# EAGLE design ascender_board (EAGLE 6.6.0)
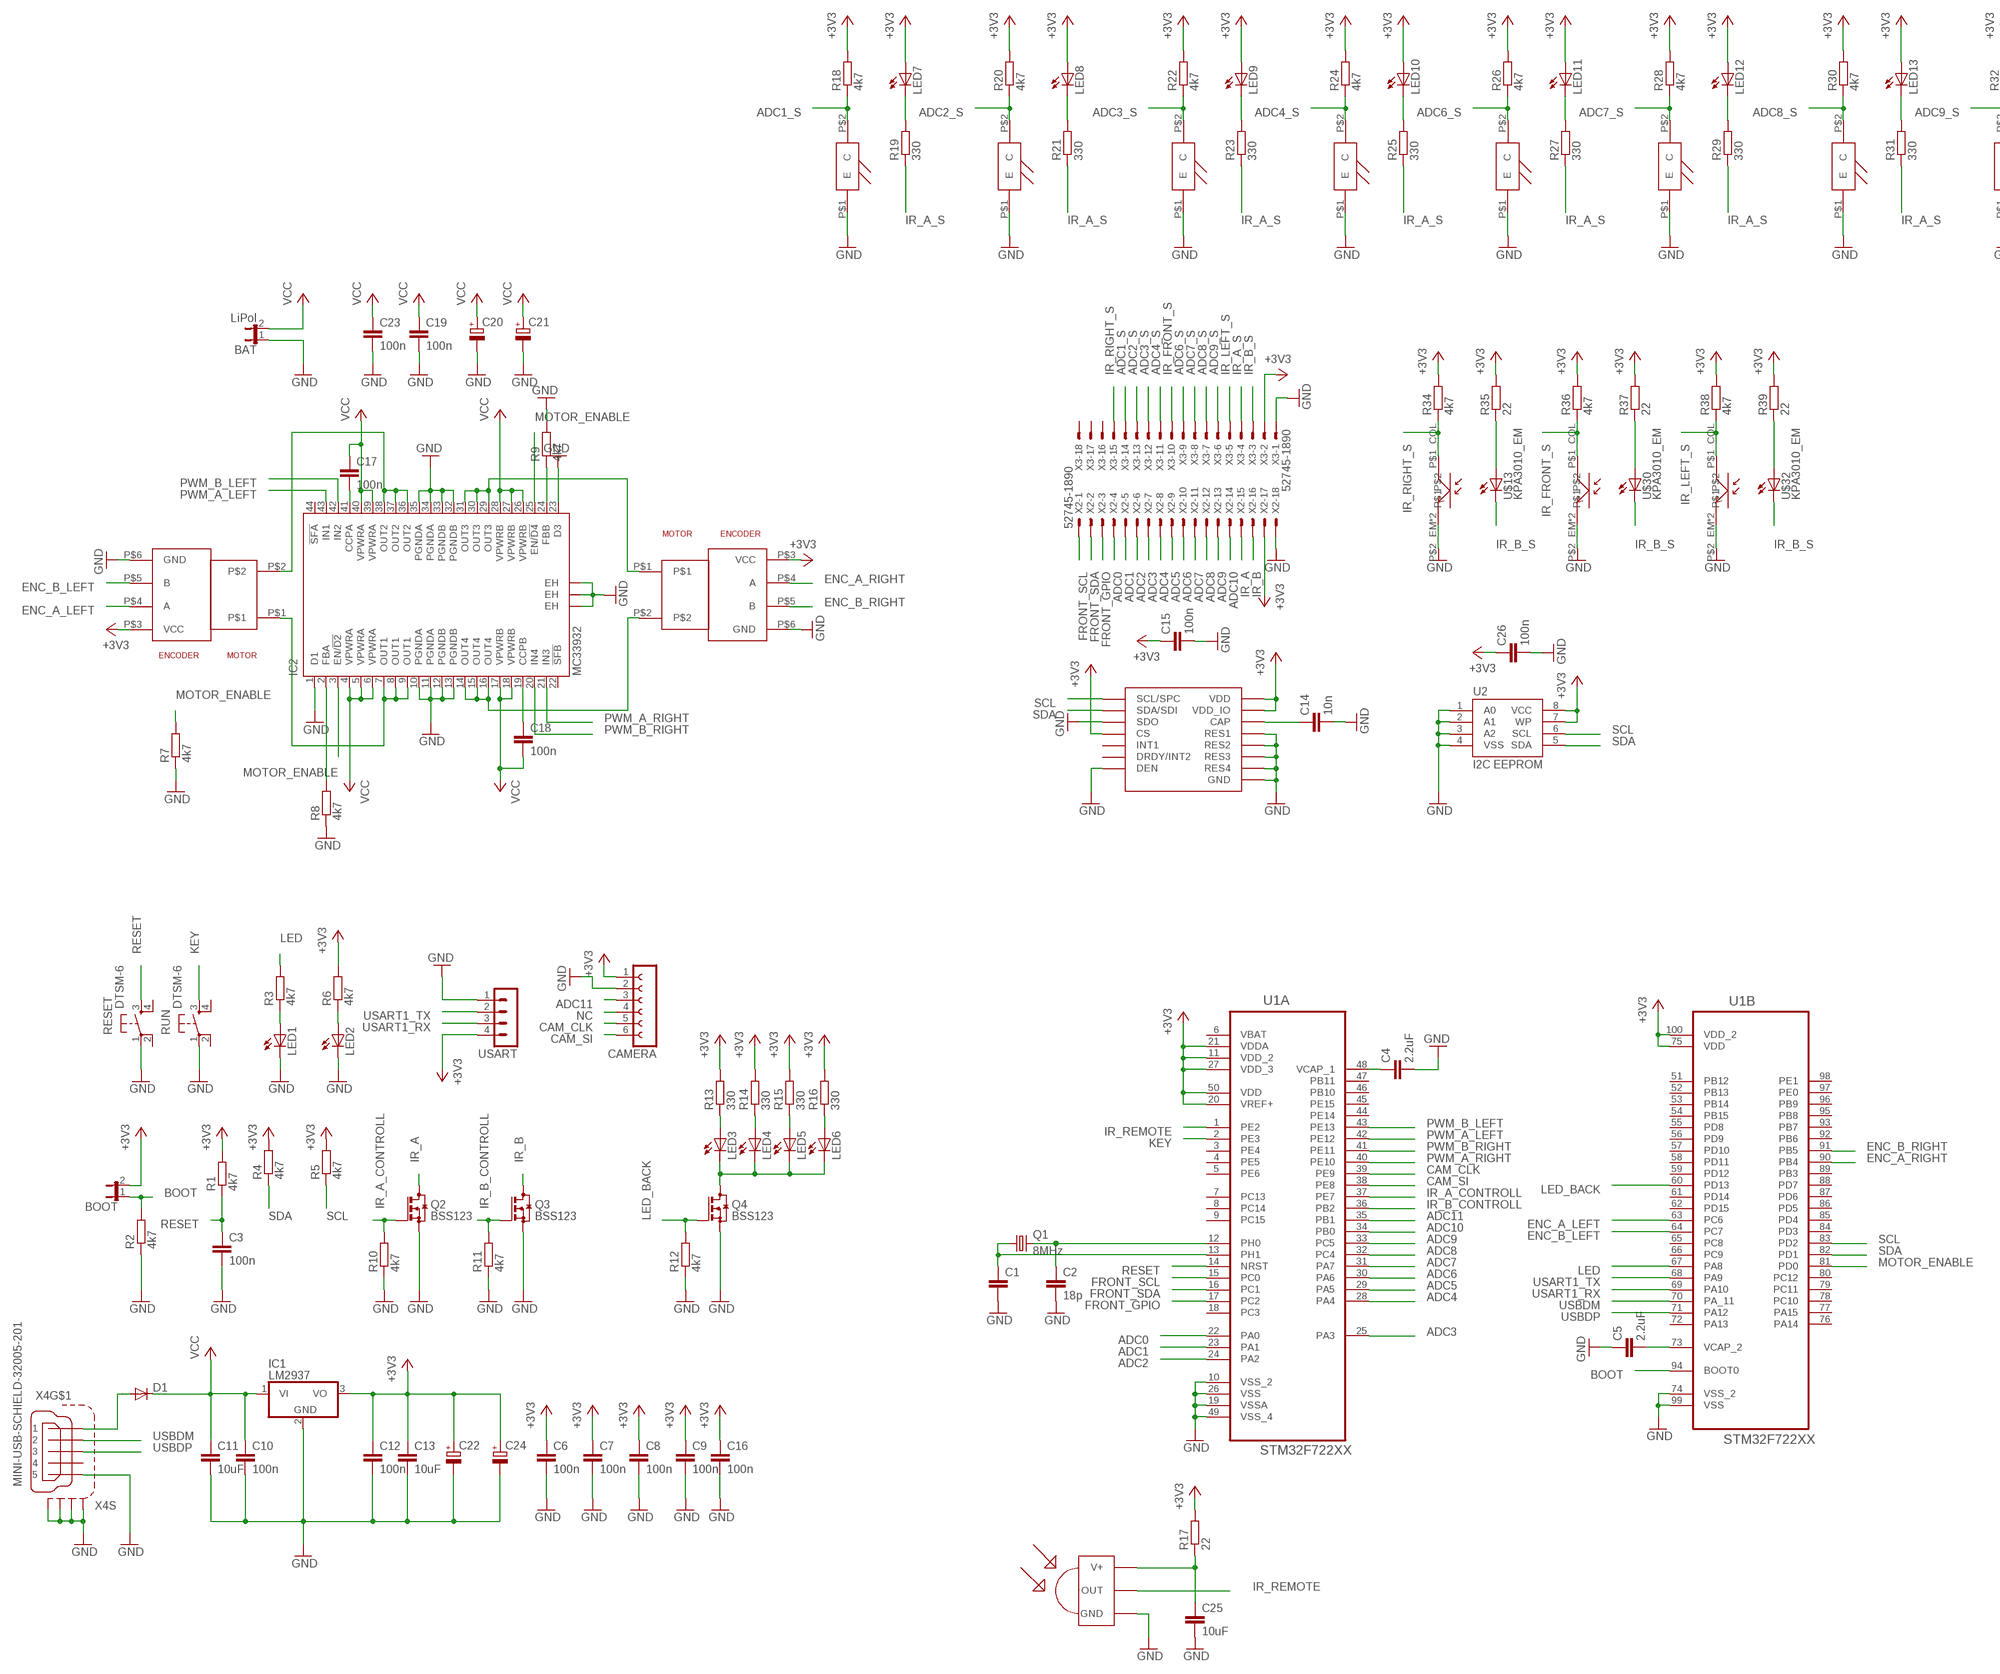
[diagram p0: schematic, sheet 1, part 1 of 2]
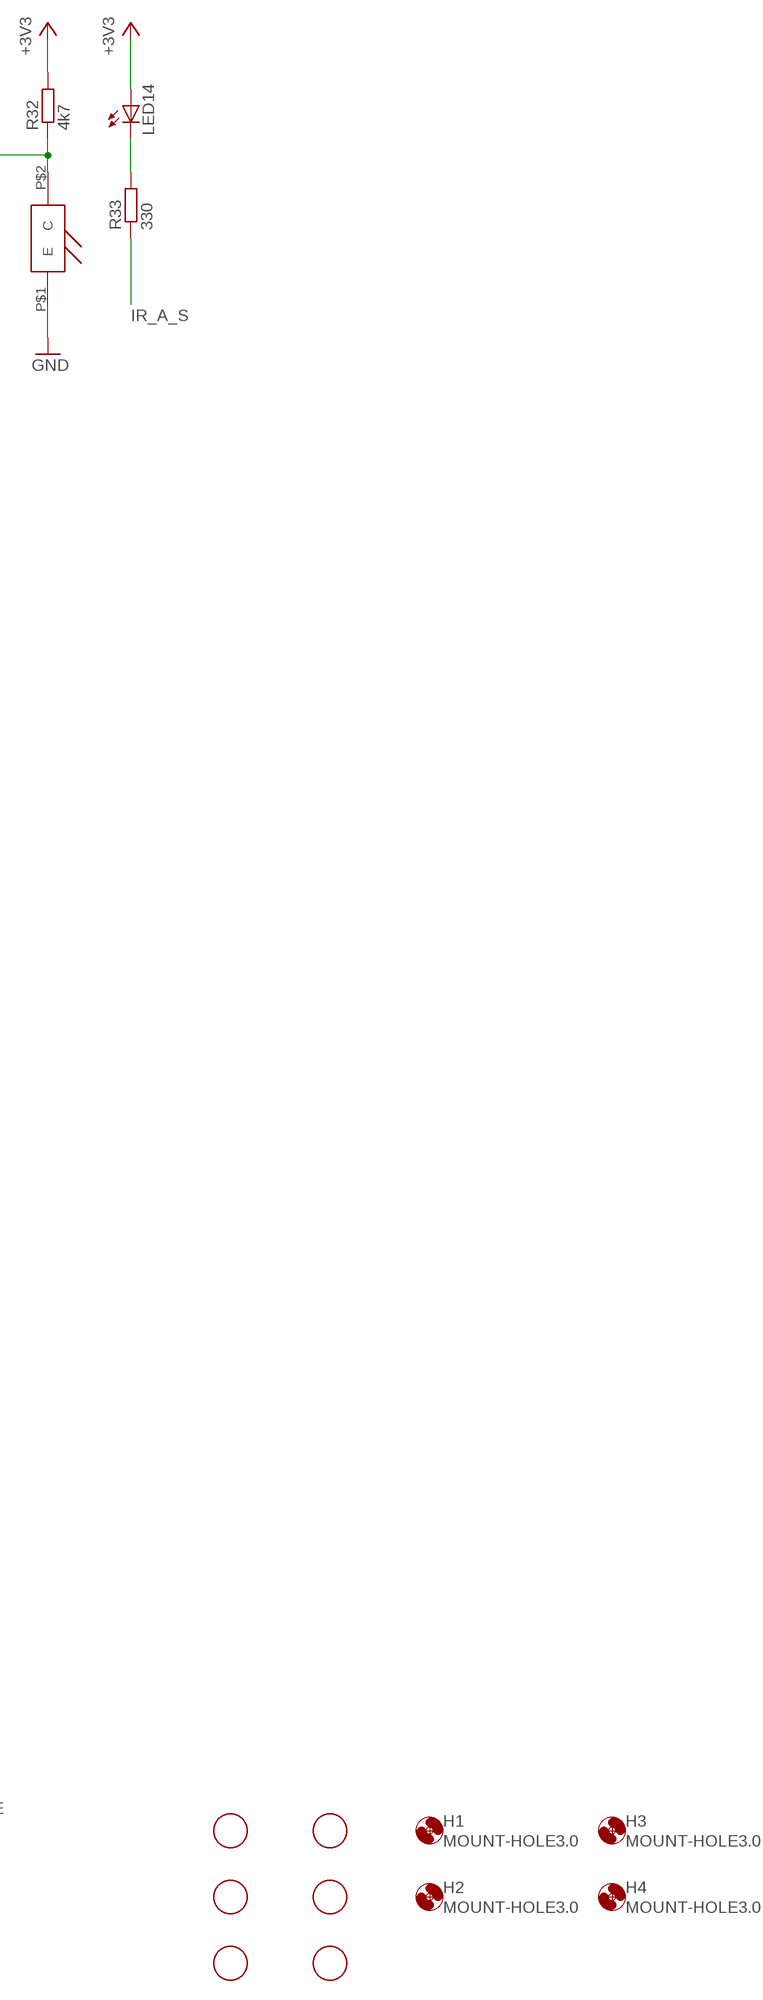
[diagram p1: schematic, sheet 1, part 2 of 2]

## Parts
BAT  LiPol  JP1E  [JP1]
BOOT  JP1E  [JP1]
C1  C-EUC0805  [C0805]
C2  18p  C-EUC0805  [C0805]
C3  100n  C-EUC0805  [C0805]
C4  2.2uF  C-EUC0805  [C0805]
C5  2.2uF  C-EUC0805  [C0805]
C6  100n  C-EUC0805  [C0805]
C7  100n  C-EUC0805  [C0805]
C8  100n  C-EUC0805  [C0805]
C9  100n  C-EUC0805  [C0805]
C10  100n  C-EUC0805  [C0805]
C11  10uF  C-EUC0805  [C0805]
C12  100n  C-EUC0805  [C0805]
C13  10uF  C-EUC0805  [C0805]
C14  10n  C-EUC0805  [C0805]
C15  100n  C-EUC0805  [C0805]
C16  100n  C-EUC0805  [C0805]
C17  100n  C-EUC0805  [C0805]
C18  100n  C-EUC0805  [C0805]
C19  100n  C-EUC0805  [C0805]
C20  CPOL-EU153CLV-0505  [153CLV-0505]
C21  CPOL-EU153CLV-0505  [153CLV-0505]
C22  CPOL-EU153CLV-0505  [153CLV-0505]
C23  100n  C-EUC0805  [C0805]
C24  CPOL-EU153CLV-0505  [153CLV-0505]
C25  10uF  C-EUC0805  [C0805]
C26  100n  C-EUC0805  [C0805]
CAMERA  FE06-1  [FE06]
D1  DIODE-DO-214AC  [DO-214AC]
H1  MOUNT-HOLE3.0  [3,0]
H2  MOUNT-HOLE3.0  [3,0]
H3  MOUNT-HOLE3.0  [3,0]
H4  MOUNT-HOLE3.0  [3,0]
IC1  LM2937  [TO263-3]
IC2  MC33932  [HSOP44]
LED1  LEDCHIPLED_1206  [CHIPLED_1206]
LED2  LEDCHIPLED_1206  [CHIPLED_1206]
LED3  LEDCHIPLED_1206  [CHIPLED_1206]
LED4  LEDCHIPLED_1206  [CHIPLED_1206]
LED5  LEDCHIPLED_1206  [CHIPLED_1206]
LED6  LEDCHIPLED_1206  [CHIPLED_1206]
LED7  LEDCHIPLED_1206  [CHIPLED_1206]
LED8  LEDCHIPLED_1206  [CHIPLED_1206]
LED9  LEDCHIPLED_1206  [CHIPLED_1206]
LED10  LEDCHIPLED_1206  [CHIPLED_1206]
LED11  LEDCHIPLED_1206  [CHIPLED_1206]
LED12  LEDCHIPLED_1206  [CHIPLED_1206]
LED13  LEDCHIPLED_1206  [CHIPLED_1206]
LED14  LEDCHIPLED_1206  [CHIPLED_1206]
Q1  8MHz  CRYSTALCTS406  [CTS406]
Q2  BSS123  [SOT23]
Q3  BSS123  [SOT23]
Q4  BSS123  [SOT23]
R1  4k7  R-EU_M0805  [M0805]
R2  4k7  R-EU_M0805  [M0805]
R3  4k7  R-EU_M0805  [M0805]
R4  4k7  R-EU_M0805  [M0805]
R5  4k7  R-EU_M0805  [M0805]
R6  4k7  R-EU_M0805  [M0805]
R7  4k7  R-EU_M0805  [M0805]
R8  4k7  R-EU_M0805  [M0805]
R9  4k7  R-EU_M0805  [M0805]
R10  4k7  R-EU_M0805  [M0805]
R11  4k7  R-EU_M0805  [M0805]
R12  4k7  R-EU_M0805  [M0805]
R13  330  R-EU_M0805  [M0805]
R14  330  R-EU_M0805  [M0805]
R15  330  R-EU_M0805  [M0805]
R16  330  R-EU_M0805  [M0805]
R17  22  R-EU_M0805  [M0805]
R18  4k7  R-EU_M0805  [M0805]
R19  330  R-EU_M0805  [M0805]
R20  4k7  R-EU_M0805  [M0805]
R21  330  R-EU_M0805  [M0805]
R22  4k7  R-EU_M0805  [M0805]
R23  330  R-EU_M0805  [M0805]
R24  4k7  R-EU_M0805  [M0805]
R25  330  R-EU_M0805  [M0805]
R26  4k7  R-EU_M0805  [M0805]
R27  330  R-EU_M0805  [M0805]
R28  4k7  R-EU_M0805  [M0805]
R29  330  R-EU_M0805  [M0805]
R30  4k7  R-EU_M0805  [M0805]
R31  330  R-EU_M0805  [M0805]
R32  4k7  R-EU_M0805  [M0805]
R33  330  R-EU_M0805  [M0805]
R34  4k7  R-EU_M0805  [M0805]
R35  22  R-EU_M0805  [M0805]
R36  4k7  R-EU_M0805  [M0805]
R37  22  R-EU_M0805  [M0805]
R38  4k7  R-EU_M0805  [M0805]
R39  22  R-EU_M0805  [M0805]
RESET  DTSM-6  [DTSM-6]
RUN  DTSM-6  [DTSM-6]
U1  STM32F722XX  [QFP50P1600X1600X160-100N]
U2  I2C EEPROM  EEPROM-I2CEIAJ  [SO08-EIAJ]
U$1  POLOLU_GEAR_MOTORPOLO  [POLOLU_GEAR_MOTOR]
U$2  ST_L3GD20H  [ST_LGA16L]
U$3  FIDUCIAL  [FIDUCIAL_1MM]
U$4  FIDUCIAL  [FIDUCIAL_1MM]
U$5  FIDUCIAL  [FIDUCIAL_1MM]
U$6  FIDUCIAL  [FIDUCIAL_1MM]
U$7  FIDUCIAL  [FIDUCIAL_1MM]
U$8  FIDUCIAL  [FIDUCIAL_1MM]
U$9  TSOP4830  [TSOP18XX]
U$10  POLOLU_GEAR_MOTORPOLO  [POLOLU_GEAR_MOTOR]
U$11  SFH3710  [SFH3710]
U$12  KPA3010  [KPA3010]
U$13  KPA3010_EM  [KPA3010]
U$14  SFH3710  [SFH3710]
U$15  SFH3710  [SFH3710]
U$16  SFH3710  [SFH3710]
U$17  SFH3710  [SFH3710]
U$18  SFH3710  [SFH3710]
U$19  SFH3710  [SFH3710]
U$20  SFH3710  [SFH3710]
U$29  KPA3010  [KPA3010]
U$30  KPA3010_EM  [KPA3010]
U$31  KPA3010  [KPA3010]
U$32  KPA3010_EM  [KPA3010]
USART  MA04-1  [MA04-1]
X2  52745-1890  [52745-1890]
X3  52745-1890  [52745-1890]
X4  MINI-USB-SCHIELD-32005-201  [32005-201]

## Nets
+3V3: BOOT.2 C6.1 C7.1 C8.1 C9.1 C12.1 C13.1 C15.1 C16.1 C22.+ C24.+ C26.1 CAMERA.1 IC1.3(VO) LED7.A LED8.A LED9.A LED10.A LED11.A LED12.A LED13.A LED14.A R1.2 R4.2 R5.2 R6.2 R13.2 R14.2 R15.2 R16.2 R17.2 R18.2 R20.2 R22.2 R24.2 R26.2 R28.2 R30.2 R32.2 R34.2 R35.2 R36.2 R37.2 R38.2 R39.2 U1.11(A:VDD_2) U1.20(A:VREF+) U1.21(A:VDDA) U1.27(A:VDD_3) U1.50(A:VDD) U1.75(B:VDD) U1.100(B:VDD_2) U2.7(WP) U2.8(VCC) U$1.P$3(VCC) U$2.P$1(VDD_IO) U$2.P$5(CS) U$2.P$16(VDD) U$10.P$3(VCC) USART.4 X2.17 X3.2
ADC0: U1.22(A:PA0) X2.4
ADC1: U1.23(A:PA1) X2.5
ADC1_S: R18.1 U$11.P$2(C) X3.14
ADC2: U1.24(A:PA2) X2.6
ADC2_S: R20.1 U$14.P$2(C) X3.13
ADC3: U1.25(A:PA3) X2.7
ADC3_S: R22.1 U$15.P$2(C) X3.12
ADC4: U1.28(A:PA4) X2.8
ADC4_S: R24.1 U$16.P$2(C) X3.11
ADC5: U1.29(A:PA5) X2.9
ADC6: U1.30(A:PA6) X2.10
ADC6_S: R26.1 U$17.P$2(C) X3.9
ADC7: U1.31(A:PA7) X2.11
ADC7_S: R28.1 U$18.P$2(C) X3.8
ADC8: U1.32(A:PC4) X2.12
ADC8_S: R30.1 U$19.P$2(C) X3.7
ADC9: U1.33(A:PC5) X2.13
ADC9_S: R32.1 U$20.P$2(C) X3.6
ADC10: U1.34(A:PB0) X2.14
ADC11: CAMERA.3 U1.35(A:PB1)
BOOT: BOOT.1 R2.2 U1.94(B:BOOT0)
CAM_CLK: CAMERA.5 U1.39(A:PE9)
CAM_SI: CAMERA.6 U1.38(A:PE8)
ENC_A_LEFT: U1.63(B:PC6) U$10.P$4(A)
ENC_A_RIGHT: U1.90(B:PB4) U$1.P$4(A)
ENC_B_LEFT: U1.64(B:PC7) U$10.P$5(B)
ENC_B_RIGHT: U1.91(B:PB5) U$1.P$5(B)
FRONT_GPIO: U1.17(A:PC2) X2.3
FRONT_SCL: U1.15(A:PC0) X2.1
FRONT_SDA: U1.16(A:PC1) X2.2
GND: BAT.1 C1.2 C2.2 C3.2 C4.2 C5.1 C6.2 C7.2 C8.2 C9.2 C10.2 C11.2 C12.2 C13.2 C14.2 C15.2 C16.2 C19.2 C20.- C21.- C22.- C23.2 C24.- C25.2 C26.2 CAMERA.2 IC1.2(GND) IC2.1(D1) IC2.10(PGNDA) IC2.11(PGNDA) IC2.12(PGNDB) IC2.13(PGNDB) IC2.23(D3) IC2.32(PGNDB) IC2.33(PGNDB) IC2.34(PGNDA) IC2.35(PGNDA) IC2.EH@1(EH) IC2.EH@2(EH) IC2.EH@3(EH) LED1.C LED2.C Q2.2(S) Q3.2(S) Q4.2(S) R2.1 R7.1 R8.1 R9.2 R10.1 R11.1 R12.1 RESET.1 RUN.1 U1.10(A:VSS_2) U1.19(A:VSSA) U1.26(A:VSS) U1.49(A:VSS_4) U1.74(B:VSS_2) U1.99(B:VSS) U2.1(A0) U2.2(A1) U2.3(A2) U2.4(VSS) U$1.P$6(GND) U$2.P$4(SDO) U$2.P$8(DEN) U$2.P$9(RES1) U$2.P$10(RES2) U$2.P$11(RES3) U$2.P$12(GND) U$2.P$13(GND) U$2.P$15(RES4) U$9.GND U$10.P$6(GND) U$11.P$1(E) U$12.P$2_EM U$12.P$3-NC U$14.P$1(E) U$15.P$1(E) U$16.P$1(E) U$17.P$1(E) U$18.P$1(E) U$19.P$1(E) U$20.P$1(E) U$29.P$2_EM U$29.P$3-NC U$31.P$2_EM U$31.P$3-NC USART.1 X2.18 X3.1 X4.5 X4.M1(S:S1) X4.M2(S:S2) X4.M3(S:S3) X4.M4(S:S4)
IR_A: Q2.3(D) X2.15
IR_A_CONTROLL: Q2.1(G) R10.2 U1.37(A:PE7)
IR_A_S: R19.1 R21.1 R23.1 R25.1 R27.1 R29.1 R31.1 R33.1 X3.4
IR_B: Q3.3(D) X2.16
IR_B_CONTROLL: Q3.1(G) R11.2 U1.36(A:PB2)
IR_B_S: U$13.P$1_COL(C) U$30.P$1_COL(C) U$32.P$1_COL(C) X3.3
IR_FRONT_S: R36.1 U$29.P$1_COL X3.10
IR_LEFT_S: R38.1 U$31.P$1_COL X3.5
IR_REMOTE: U1.1(A:PE2) U$9.OUT
IR_RIGHT_S: R34.1 U$12.P$1_COL X3.15
KEY: RUN.3 U1.2(A:PE3)
LED: R3.2 U1.67(B:PA8)
LED_BACK: Q4.1(G) R12.2 U1.60(B:PD13)
MOTOR_ENABLE: IC2.3(EN/!D2) IC2.25(EN/!D4) R7.2 U1.81(B:PD0)
N$1: C2.1 Q1.3 U1.12(A:PH0)
N$2: C1.1 Q1.1 U1.13(A:PH1)
N$3: C4.1 U1.48(A:VCAP_1)
N$4: C5.2 U1.73(B:VCAP_2)
N$5: LED1.A R3.1
N$6: C14.1 U$2.P$14(CAP)
N$7: IC2.7(OUT1) IC2.8(OUT1) IC2.9(OUT1) U$10.P$1
N$8: IC2.36(OUT2) IC2.37(OUT2) IC2.38(OUT2) U$10.P$2
N$9: IC2.14(OUT4) IC2.15(OUT4) IC2.16(OUT4) U$1.P$2
N$10: IC2.29(OUT3) IC2.30(OUT3) IC2.31(OUT3) U$1.P$1
N$11: LED2.A R6.1
N$12: C17.2 IC2.41(CCPA)
N$13: IC2.2(FBA) R8.2
N$14: C18.1 IC2.19(CCPB)
N$15: IC2.24(FBB) R9.1
N$16: LED3.C LED4.C LED5.C LED6.C Q4.3(D)
N$17: LED3.A R13.1
N$18: D1.A X4.1
N$19: LED4.A R14.1
N$20: C25.1 R17.1 U$9.VCC(V+)
N$21: LED5.A R15.1
N$22: LED8.C R21.2
N$23: LED6.A R16.1
N$24: LED7.C R19.2
N$25: LED9.C R23.2
N$26: LED10.C R25.2
N$27: LED11.C R27.2
N$28: LED12.C R29.2
N$29: LED13.C R31.2
N$30: LED14.C R33.2
N$31: R37.1 U$30.P$2_EM(A) U$30.P$3-NC(A)
N$32: R35.1 U$13.P$2_EM(A) U$13.P$3-NC(A)
N$33: R39.1 U$32.P$2_EM(A) U$32.P$3-NC(A)
NC: CAMERA.4
PWM_A_LEFT: IC2.43(IN1) U1.42(A:PE12)
PWM_A_RIGHT: IC2.21(IN3) U1.40(A:PE10)
PWM_B_LEFT: IC2.42(IN2) U1.43(A:PE13)
PWM_B_RIGHT: IC2.20(IN4) U1.41(A:PE11)
RESET: C3.1 R1.1 RESET.3 U1.14(A:NRST)
SCL: R5.1 U1.83(B:PD2) U2.6(SCL) U$2.P$2(SCL/SPC)
SDA: R4.1 U1.82(B:PD1) U2.5(SDA) U$2.P$3(SDA/SDI)
USART1_RX: U1.69(B:PA10) USART.3
USART1_TX: U1.68(B:PA9) USART.2
USBDM: U1.70(B:PA_11) X4.2
USBDP: U1.71(B:PA12) X4.3
VCC: BAT.2 C10.1 C11.1 C17.1 C18.2 C19.1 C20.+ C21.+ C23.1 D1.C IC1.1(VI) IC2.4(VPWRA) IC2.5(VPWRA) IC2.6(VPWRA) IC2.17(VPWRB) IC2.18(VPWRB) IC2.26(VPWRB) IC2.27(VPWRB) IC2.28(VPWRB) IC2.39(VPWRA) IC2.40(VPWRA)
Unconnected: IC2.22(!SFB) IC2.44(!SFA) RESET.2 RESET.4 RUN.2 RUN.4 U1.3(A:PE4) U1.4(A:PE5) U1.5(A:PE6) U1.7(A:PC13) U1.8(A:PC14) U1.9(A:PC15) U1.18(A:PC3) U1.44(A:PE14) U1.45(A:PE15) U1.46(A:PB10) U1.47(A:PB11) U1.51(B:PB12) U1.52(B:PB13) U1.53(B:PB14) U1.54(B:PB15) U1.55(B:PD8) U1.56(B:PD9) U1.57(B:PD10) U1.58(B:PD11) U1.59(B:PD12) U1.61(B:PD14) U1.62(B:PD15) U1.65(B:PC8) U1.66(B:PC9) U1.72(B:PA13) U1.76(B:PA14) U1.77(B:PA15) U1.78(B:PC10) U1.79(B:PC11) U1.80(B:PC12) U1.84(B:PD3) U1.85(B:PD4) U1.86(B:PD5) U1.87(B:PD6) U1.88(B:PD7) U1.89(B:PB3) U1.92(B:PB6) U1.93(B:PB7) U1.95(B:PB8) U1.96(B:PB9) U1.97(B:PE0) U1.98(B:PE1) U$2.P$6(DRDY/INT2) U$2.P$7(INT1) X3.16 X3.17 X3.18 X4.4

## Power pins joined to a net without a drawn wire
VBAT: U1.6(A:VBAT)

## Library data of the parts
BAT BOOT = jumper:JP1E: JUMPER
C1-C19 C23 C25 C26 = resistor:C-EU: CAPACITOR, European symbol
C20-C22 C24 = resistor:CPOL-EU: POLARIZED CAPACITOR, European symbol
CAMERA = con-lsta:FE06-1: FEMALE HEADER; OC_FARNELL: unknown; OC_NEWARK: unknown
D1 = diode:DIODE-: DIODE
H1-H4 = holes:MOUNT-HOLE: MOUNTING HOLE with drill center marker
IC1 = my_parts:LM2937: LM2937-2.5, LM2937-3.3 400mA and 500mA Voltage Regulators Source: http://cache.national.com/ds/LM/LM2937-2.5.pdf
IC2 = freescale:MC33932: 5.0 A Throttle Control H-Bridge Auto generated by make-symbol-device-package-bsdl.ulp Rev. 33 Source: http://www.freescale.com/files/analog/doc/data_sheet/MC33932.pdf?fpsp=1; MPN: MC33932VW; OC_FARNELL: 1701639; OC_NEWARK: 67P3304
LED1-LED14 = my_parts:LED: LED OSRAM: - CHIPLED LG R971, LG N971, LY N971, LG Q971, LY Q971, LO R971, LY R971 LH N974, LH R974 LS Q976, LO Q976, LY Q976 LO Q996 - Hyper CHIPLED LW Q18S LB Q993, LB Q99A, LB R99A - SideLED LS A670, LO A670, LY A670, LG A670, LP A670 LB A673, LV A673, LT A673, LW A673 LH A674 LY A675 LS A676, LA A676, LO A676, LY A676, LW A676 LS A679, LY A679, LG A679 - Hyper Micro SIDELED® LS Y876, LA Y876, LO Y876, LY Y876 LT Y87S - SmartLED LW L88C, LW L88S LB L89C, LB L89S, LG L890 LS L89K, LO L89K, LY L89K LS L896, LA L896, LO L896, LY L896 - TOPLED LS T670, LO T670, LY T670, LG T670, LP T670 LSG T670, LSP T670, LSY T670, LOP T670, LYG T670 LG T671, LOG T671, LSG T671 LB T673, LV T673, LT T673, LW T673 LH T674 LS T676, LA T676, LO T676, LY T676, LB T676, LH T676, LSB T676, LW T676 LB T67C, LV T67C, LT T67C, LS T67K, LO T67K, LY T67K, LW E67C LS E67B, LA E67B, LO E67B, LY E67B, LB E67C, LV E67C, LT E67C LW T67C LS T679, LY T679, LG T679 LS T770, LO T770, LY T770, LG T770, LP T770 LB T773, LV T773, LT T773, LW T773 LH T774 LS E675, LA E675, LY E675, LS T675 LS T776, LA T776, LO T776, LY T776, LB T776 LHGB T686 LT T68C, LB T68C - Hyper Mini TOPLED® LB M676 - Mini TOPLED Santana® LG M470 LS M47K, LO M47K, LY M47K Source: http://www.osram.convergy.de LUXEON: - LUMILED® LXK2-PW12-R00, LXK2-PW12-S00, LXK2-PW14-U00, LXK2-PW14-V00 LXK2-PM12-R00, LXK2-PM12-S00, LXK2-PM14-U00 LXK2-PE12-Q00, LXK2-PE12-R00, LXK2-PE12-S00, LXK2-PE14-T00, LXK2-PE14-U00 LXK2-PB12-K00, LXK2-PB12-L00, LXK2-PB12-M00, LXK2-PB14-N00, LXK2-PB14-P00, LXK2-PB14-Q00 LXK2-PR12-L00, LXK2-PR12-M00, LXK2-PR14-Q00, LXK2-PR14-R00 LXK2-PD12-Q00, LXK2-PD12-R00, LXK2-PD12-S00 LXK2-PH12-R00, LXK2-PH12-S00 LXK2-PL12-P00, LXK2-PL12-Q00, LXK2-PL12-R00 Source: www.luxeon.com KINGBRIGHT: KA-3528ASYC Source: www.kingbright.com
Q1 = crystal:CRYSTAL: CRYSTAL; OC_FARNELL: unknown; OC_NEWARK: unknown
Q2-Q4 = transistor-small-signal:BSS123: N-CHANNEL MOS FET
R1-R39 = resistor:R-EU_: RESISTOR, European symbol
RESET RUN = switch-tact:DTSM-6
U1 = stm32:STM32F722XX: IC, MCU, 32BIT, 512K FLASH, 100LQFP; MPN: STM32F407VET6; OC_FARNELL: 2064367; OC_NEWARK: 73T2332; PACKAGE: 100LQFP; SUPPLIER: STMicroelectronics
U2 = SparkFun-IC-Memory:EEPROM-I2C: I2C EEPROMs, 24LC256 and others 24LC256 Series 256 kb I2C 2 Wire (32 k x 8 Bit) 2.5 V Serial EEPROM SMD - SOIC-8 Datasheet SparkFun Products SparkFun UDB5 - PIC UAV Development Board <https://www.sparkfun.com/products/11703> (GPS-11703); PROD_ID: NA-XXXXX
U$1 U$10 = my_parts:POLOLU_GEAR_MOTOR
U$2 = main:ST_L3GD20H
U$3-U$8 = adafruit:FIDUCIAL: For use by pick and place machines to calibrate the vision/machine, 1mm By microbuilder.eu
U$9 = tsop:TSOP4830: IR Receiver and Demodulator
U$11 U$14-U$20 = my_parts:SFH3710
U$12 U$29 U$31 = my_parts:KPA3010
U$13 U$30 U$32 = my_parts:KPA3010_EM
USART = con-lstb:MA04-1: PIN HEADER; OC_FARNELL: unknown; OC_NEWARK: unknown
X2 X3 = con-molex:52745-1890: FFC/FPC-to-Board 0.50mm (.020") SMT Top Contact Right Angle, ZIF, Style Receptacle 52745 / 52435 Source: http://www.molex.com/product/ffc/52745.html; MPN: 52745-1890; OC_FARNELL: unknown; OC_NEWARK: 66F4273
X4 = con-cypressindustries:MINI-USB-SCHIELD-: MINI USB-B Conector Source: www.cypressindustries.com; OC_FARNELL: unknown; OC_NEWARK: unknown

## Board
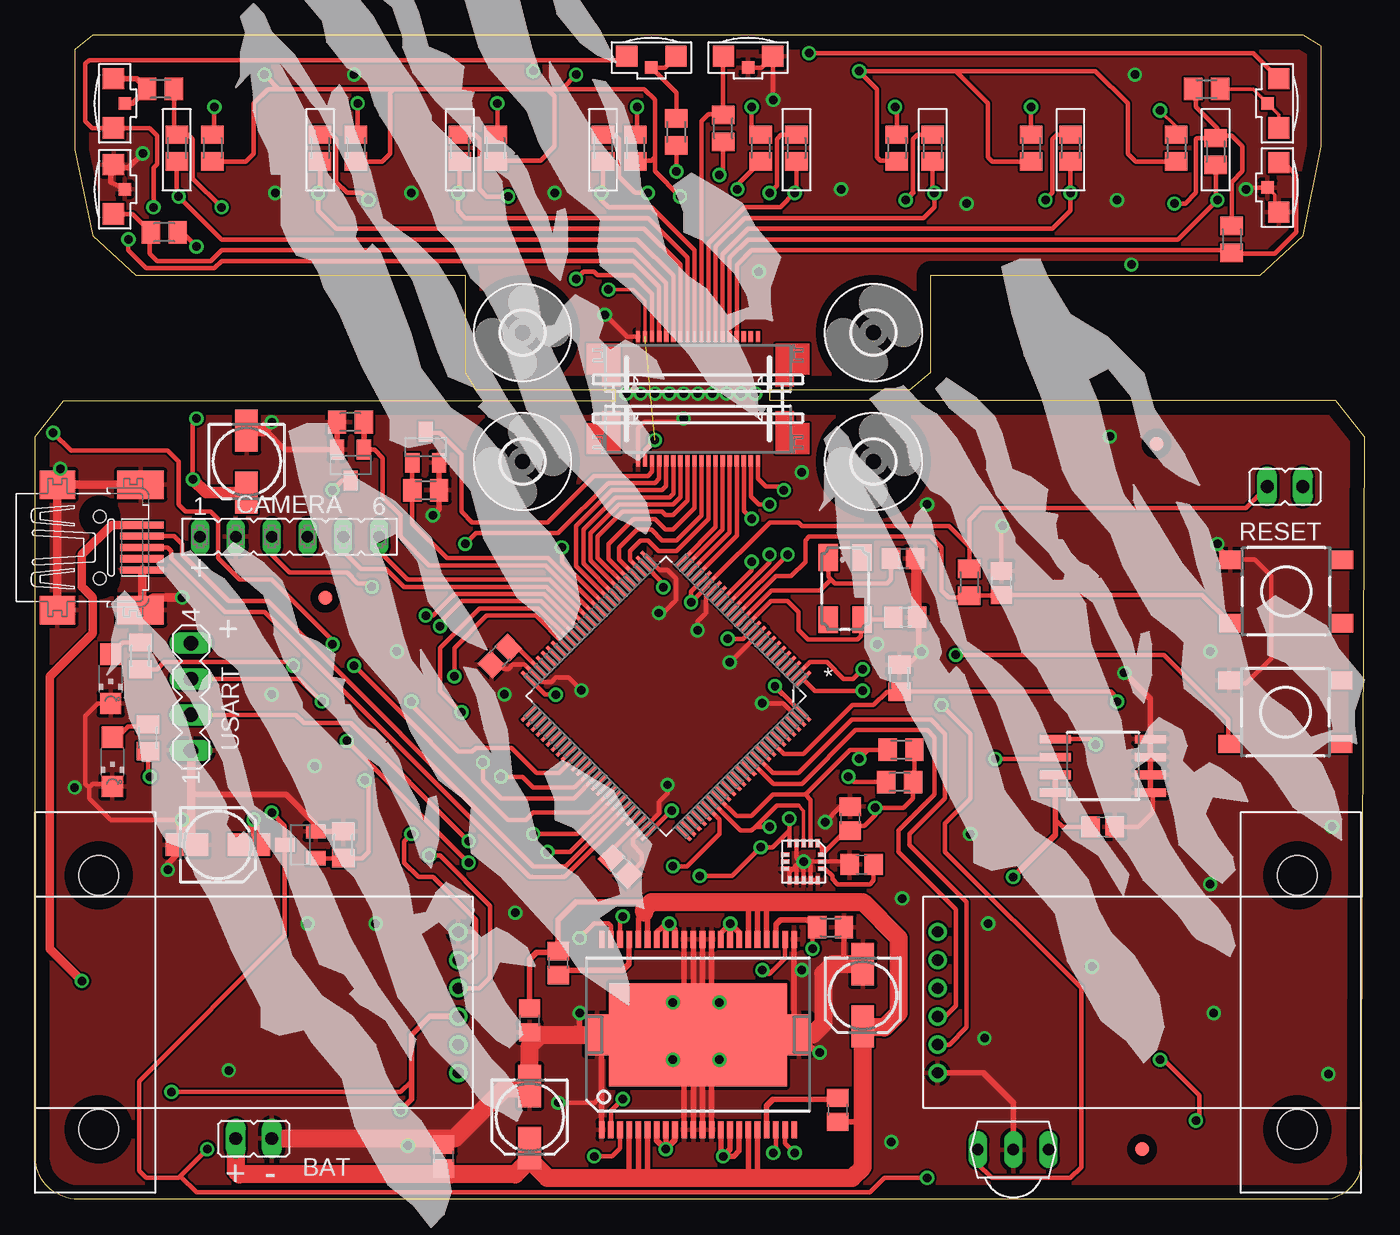
[diagram p2: board, top side]
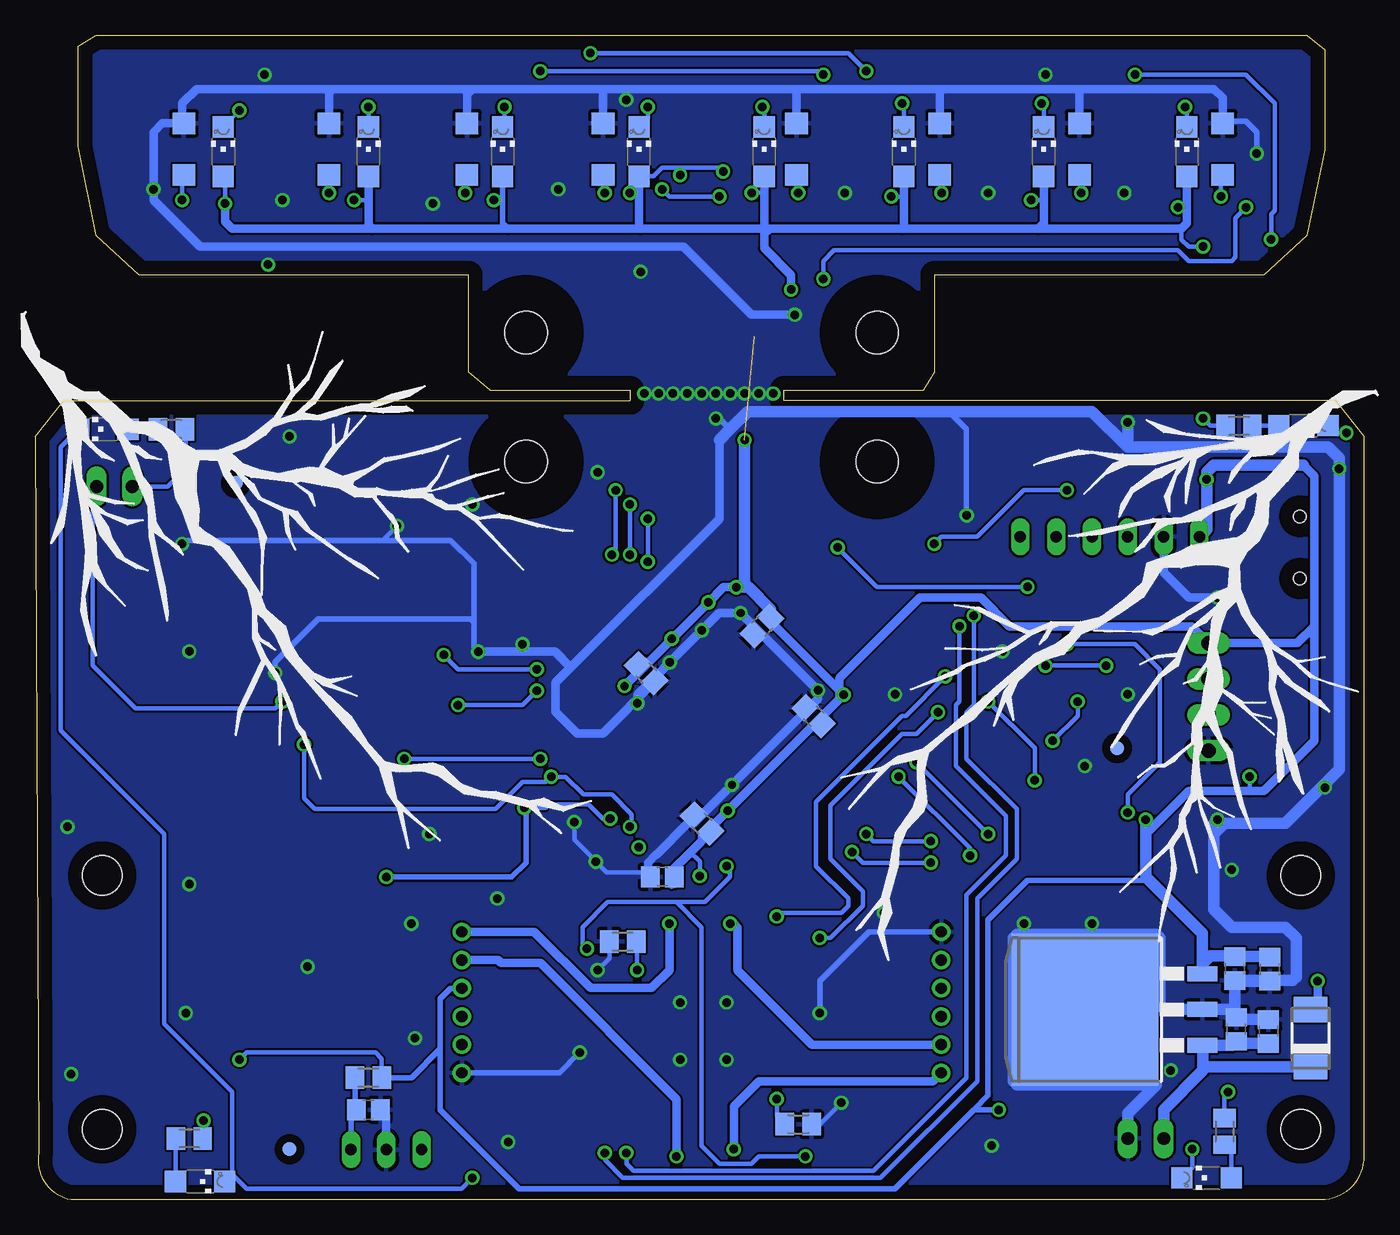
[diagram p3: board, bottom side, seen from below]

Size 94.23 x 82.55 mm. Coordinates in mm from the lower left corner, seen from the top.
Outline: 61.98,57.4 63.5,58.67 63.5,65.53 86.87,65.53 89.92,68.33 91.19,74.68 91.19,81.79 89.92,82.55 4.06,82.55 2.79,81.53 2.79,74.42 4.06,68.33 7.11,65.53 30.48,65.53 30.48,58.67 31.24,57.4 41.15,57.4 41.15,56.64 2.03,56.64 0,54.1 0,3.05 arc90 3.05,0 91.69,0 arc90 93.98,3.3 94.23,54.1 92.2,56.64 52.07,56.64 52.07,57.4 61.98,57.4
Copper layers (1*16): Top 0.035mm / dielectric 1.5mm / Bottom 0.035mm
Design rules "default *": minimum track width 8mil, minimum drill 24mil, track to track 6mil, track to pad 6mil, pad to pad 6mil, via to via 6mil, smd to smd 0mil, copper to edge 40mil, drill to drill 8mil, minimum pad ring 10mil, minimum via ring 8mil, stop-mask expansion 4mil, vias tented up to drill 0mil, thermal gap 10mil

### Footprints (pad centres in the part's own frame; a part is rotated, then mirrored left to right if it is on the bottom)
JP1 = drill 0.914 long: 1 0,-1.27; 2 0,1.27
C0805 = smd 1.3 x 1.5: 1 -0.85,0; 2 0.85,0
153CLV-0505 = smd 3 x 1.6: + 2.2,0; - -2.2,0
FE06 = drill 0.813 long: 1 -6.35,0; 2 -3.81,0; 3 -1.27,0; 4 1.27,0; 5 3.81,0; 6 6.35,0
DO-214AC = smd 1.8 x 2.4: A 2.025,0; C -2.025,0
3,0 = hole 3: 0,0
TO263-3 = smd 1.067 x 2.159: 1 -2.54,-5.791; 2 0,-5.791; 3 2.54,-5.791 | smd 10.8 x 10.41: TAB 0,2.54
HSOP44 = smd 0.4 x 1.2: 1 -6.825,-6.75; 2 -6.175,-6.75; 3 -5.525,-6.75; 4 -4.875,-6.75; 5 -4.225,-6.75; 6 -3.575,-6.75; 7 -2.925,-6.75; 8 -2.275,-6.75; 9 -1.625,-6.75; 10 -0.975,-6.75; 11 -0.325,-6.75; 12 0.325,-6.75; 13 0.975,-6.75; 14 1.625,-6.75; 15 2.275,-6.75; 16 2.925,-6.75; 17 3.575,-6.75; 18 4.225,-6.75; 19 4.875,-6.75; 20 5.525,-6.75; 21 6.175,-6.75; 22 6.825,-6.75; 23 6.825,6.75; 24 6.175,6.75; 25 5.525,6.75; 26 4.875,6.75; 27 4.225,6.75; 28 3.575,6.75; 29 2.925,6.75; 30 2.275,6.75; 31 1.625,6.75; 32 0.975,6.75; 33 0.325,6.75; 34 -0.325,6.75; 35 -0.975,6.75; 36 -1.625,6.75; 37 -2.275,6.75; 38 -2.925,6.75; 39 -3.575,6.75; 40 -4.225,6.75; 41 -4.875,6.75; 42 -5.525,6.75; 43 -6.175,6.75; 44 -6.825,6.75 | smd 12.6 x 7.3: EH@1 0,0 | smd 1.7 x 2.9: EH@2 -7.15,0; EH@3 7.15,0
CHIPLED_1206 = smd 1.5 x 1.5: A 0,-1.75; C 0,1.75
CTS406 = smd 1.9 x 1.4: 1 -2.2,-1.2; 2 2.2,-1.2; 3 2.2,1.2; 4 -2.2,1.2
SOT23 = smd 1 x 1.4: 1 -0.95,-1.1; 2 0.95,-1.1; 3 0,1.1
M0805 = smd 1.3 x 1.6: 1 -0.95,0; 2 0.95,0
DTSM-6 = smd 1.55 x 1.3: 1 -3.975,2.25; 2 3.975,2.25; 3 -3.975,-2.25; 4 3.975,-2.25
QFP50P1600X1600X160-100N = smd 1.473 x 0.254: 1 -7.722,5.994; 2 -7.722,5.512; 3 -7.722,5.004; 4 -7.722,4.496; 5 -7.722,3.988; 6 -7.722,3.505; 7 -7.722,2.997; 8 -7.722,2.489; 9 -7.722,2.007; 10 -7.722,1.499; 11 -7.722,0.991; 12 -7.722,0.508; 13 -7.722,0; 14 -7.722,-0.508; 15 -7.722,-0.991; 16 -7.722,-1.499; 17 -7.722,-2.007; 18 -7.722,-2.489; 19 -7.722,-2.997; 20 -7.722,-3.505; 21 -7.722,-3.988; 22 -7.722,-4.496; 23 -7.722,-5.004; 24 -7.722,-5.512; 25 -7.722,-5.994; 51 7.722,-5.994; 52 7.722,-5.512; 53 7.722,-5.004; 54 7.722,-4.496; 55 7.722,-3.988; 56 7.722,-3.505; 57 7.722,-2.997; 58 7.722,-2.489; 59 7.722,-2.007; 60 7.722,-1.499; 61 7.722,-0.991; 62 7.722,-0.508; 63 7.722,0; 64 7.722,0.508; 65 7.722,0.991; 66 7.722,1.499; 67 7.722,2.007; 68 7.722,2.489; 69 7.722,2.997; 70 7.722,3.505; 71 7.722,3.988; 72 7.722,4.496; 73 7.722,5.004; 74 7.722,5.512; 75 7.722,5.994 | smd 0.254 x 1.473: 26 -5.994,-7.722; 27 -5.512,-7.722; 28 -5.004,-7.722; 29 -4.496,-7.722; 30 -3.988,-7.722; 31 -3.505,-7.722; 32 -2.997,-7.722; 33 -2.489,-7.722; 34 -2.007,-7.722; 35 -1.499,-7.722; 36 -0.991,-7.722; 37 -0.508,-7.722; 38 0,-7.722; 39 0.508,-7.722; 40 0.991,-7.722; 41 1.499,-7.722; 42 2.007,-7.722; 43 2.489,-7.722; 44 2.997,-7.722; 45 3.505,-7.722; 46 3.988,-7.722; 47 4.496,-7.722; 48 5.004,-7.722; 49 5.512,-7.722; 50 5.994,-7.722; 76 5.994,7.722; 77 5.512,7.722; 78 5.004,7.722; 79 4.496,7.722; 80 3.988,7.722; 81 3.505,7.722; 82 2.997,7.722; 83 2.489,7.722; 84 2.007,7.722; 85 1.499,7.722; 86 0.991,7.722; 87 0.508,7.722; 88 0,7.722; 89 -0.508,7.722; 90 -0.991,7.722; 91 -1.499,7.722; 92 -2.007,7.722; 93 -2.489,7.722; 94 -2.997,7.722; 95 -3.505,7.722; 96 -3.988,7.722; 97 -4.496,7.722; 98 -5.004,7.722; 99 -5.512,7.722; 100 -5.994,7.722
SO08-EIAJ = smd 0.61 x 2.21: 1 -1.905,-3.378; 2 -0.635,-3.378; 3 0.635,-3.378; 4 1.905,-3.378; 5 1.905,3.353; 6 0.635,3.353; 7 -0.635,3.353; 8 -1.905,3.353
POLOLU_GEAR_MOTOR = drill 0.8: P$1 -5,-14.5; P$2 -3,-14.5; P$3 -1,-14.5; P$4 1,-14.5; P$5 3,-14.5; P$6 5,-14.5 | hole 2.8: -9,11; 9,11
ST_LGA16L = smd 0.6 x 0.3: P$1 -1.3,1; P$2 -1.3,0.5; P$3 -1.3,0; P$4 -1.3,-0.5; P$5 -1.3,-1; P$9 1.3,-1; P$10 1.3,-0.5; P$11 1.3,0; P$12 1.3,0.5; P$13 1.3,1 | smd 0.3 x 0.6: P$6 -0.5,-1.3; P$7 0,-1.3; P$8 0.5,-1.3; P$14 0.5,1.3; P$15 0,1.3; P$16 -0.5,1.3
FIDUCIAL_1MM = smd 1 x 1: 1 0,0
TSOP18XX = drill 0.813 long: GND -0.001,-0.027; OUT -2.501,-0.027; VCC 2.499,-0.027
SFH3710 = smd 1.52 x 1.6: P$1 -1.75,0; P$2 1.9,0
KPA3010 = smd 1.5 x 1.5: P$1_COL -1.75,0.8; P$2_EM 1.75,0.8 | smd 0.9 x 0.9: P$3-NC 0,0
MA04-1 = drill 1.016 long: 1 -3.81,0; 2 -1.27,0; 3 1.27,0; 4 3.81,0
52745-1890 = smd 0.3 x 0.8: 1 -4.25,2.5; 2 -3.75,2.5; 3 -3.25,2.5; 4 -2.75,2.5; 5 -2.25,2.5; 6 -1.75,2.5; 7 -1.25,2.5; 8 -0.75,2.5; 9 -0.25,2.5; 10 0.25,2.5; 11 0.75,2.5; 12 1.25,2.5; 13 1.75,2.5; 14 2.25,2.5; 15 2.75,2.5; 16 3.25,2.5; 17 3.75,2.5; 18 4.25,2.5
32005-201 = smd 3.1 x 0.5: 1 3,1.6; 2 3,0.8; 3 3,0; 4 3,-0.8; 5 3,-1.6 | smd 2.5 x 2: M1 -3,-4.45; M2 -3,4.45 | smd 3.3 x 2: M3 2.9,4.45; M4 2.9,-4.45 | hole 0.9: 0,2.2; 0,-2.2

### Placement (x,y rotation side)
BAT  15.49,4.32 90 top
BOOT  88.62,50.55 90 top
C1  61.54,45.44 0 top
C2  61.7,41.28 0 top
C3  68.5,43.71 90 top
C4  32.94,38.53 225 top
C5  41.48,23.6 135 top
C6  42.7,40.67 225 bottom
C7  39.04,34.27 135 bottom
C8  46.96,26.65 135 bottom
C9  50.93,37.31 315 bottom
C10  9.08,12.06 90 bottom
C11  6.79,11.9 90 bottom
C12  6.69,16.32 270 bottom
C13  9.18,16.37 270 bottom
C14  58.6,23.75 180 top
C15  57.78,27 90 top
C16  49.77,22.88 180 bottom
C17  37.08,16.76 270 top
C18  56.9,6.35 270 top
C19  35.05,12.7 270 top
C20  35.05,5.84 270 top
C21  58.67,14.48 270 top
C22  12.95,25.15 0 top
C23  28.96,3.05 90 top
C24  14.99,52.32 270 top
C25  70.61,6.35 0 bottom
C26  75.69,26.42 0 top
CAMERA  18.03,46.99 0 top
D1  3.81,11.43 90 bottom
H1  59.44,61.47 0 top
H2  34.54,61.47 0 top
H3  59.44,52.32 0 top
H4  34.54,52.32 0 top
IC1  17.27,13.46 90 bottom
IC2  46.99,11.68 0 top
LED1  5.35,36.91 180 top
LED2  5.47,31.03 180 top
LED3  4.32,54.86 270 bottom
LED4  89.41,54.61 90 bottom
LED5  82.55,1.27 270 bottom
LED6  11.18,1.52 90 bottom
LED7  80.9,74.3 0 bottom
LED8  70.61,74.3 0 bottom
LED9  61.09,74.3 0 bottom
LED10  51.44,74.3 0 bottom
LED11  42.55,74.3 0 bottom
LED12  32.64,74.3 0 bottom
LED13  22.73,74.3 0 bottom
LED14  12.57,74.3 0 bottom
Q1  57.43,43.31 270 top
Q2  22.35,52.07 180 top
Q3  27.69,53.34 0 top
Q4  18.8,25.15 90 top
R1  66.22,43.77 90 top
R2  61.29,36.96 270 top
R3  7.46,38.54 270 top
R4  61.29,29.59 0 top
R5  61.39,31.88 0 top
R6  7.99,32.73 270 top
R7  56.39,19.3 180 top
R8  40.13,5.33 180 bottom
R9  52.58,18.29 180 bottom
R10  22.35,55.12 0 top
R11  27.69,50.29 180 top
R12  21.84,25.15 270 top
R13  8.89,54.86 180 bottom
R14  84.58,54.61 0 bottom
R15  83.31,4.32 0 bottom
R16  9.91,4.83 90 bottom
R17  70.61,8.64 0 bottom
R18  83.69,74.3 90 top
R19  80.9,74.55 90 top
R20  73.41,74.55 90 top
R21  70.61,74.55 90 top
R22  63.63,74.55 90 top
R23  61.09,74.55 90 top
R24  53.98,74.55 90 top
R25  51.44,74.55 90 top
R26  40.26,74.55 90 top
R27  42.55,74.55 90 top
R28  30.1,74.55 90 top
R29  32.64,74.55 90 top
R30  20.19,74.55 90 top
R31  22.73,74.55 90 top
R32  10.03,74.55 90 top
R33  12.57,74.55 90 top
R34  84.84,68.07 90 top
R35  45.47,75.69 270 top
R36  48.77,75.95 270 top
R37  8.89,78.74 0 top
R38  9.14,68.58 0 top
R39  83.06,78.74 180 top
RESET  88.7,43.11 0 top
RUN  88.65,34.54 0 top
U1  44.73,35.69 225 top
U2  75.69,30.73 90 top
U$1  78.49,13.97 270 top
U$2  54.48,23.95 270 top
U$3  78.49,3.56 0 top
U$4  79.5,53.59 0 top
U$5  20.57,42.67 0 top
U$6  17.53,32 0 bottom
U$7  76.2,3.56 0 bottom
U$8  80.01,50.8 0 bottom
U$9  69.34,3.56 0 top
U$10  15.49,13.97 90 top
U$11  83.69,74.55 270 bottom
U$12  87.38,71.75 270 top
U$13  43.69,80.26 0 top
U$14  73.41,74.55 270 bottom
U$15  63.63,74.55 270 bottom
U$16  53.98,74.55 270 bottom
U$17  40.26,74.55 270 bottom
U$18  30.1,74.55 270 bottom
U$19  20.19,74.55 270 bottom
U$20  10.03,74.55 270 bottom
U$21  [SCAR]  38.1,35.56 45 top
U$22  [SCAR]  79.5,5.59 45 top
U$23  [LIGHTNING]  95.25,22.35 0 bottom
U$24  [SCAR]  28.96,-6.1 45 top  (outside the outline)
U$25  [LIGHTNING]  39.62,57.4 270 bottom
U$29  50.55,80.26 0 top
U$30  6.35,77.72 90 top
U$31  6.35,71.63 90 top
U$32  87.38,77.72 270 top
USART  11.05,35.64 90 top
X2  46.99,54.86 180 top
X3  46.99,58.67 0 top
X4  4.57,46.23 0 top

### Tracks (layer width: path | path; a pad name or v marks a point on that pad's centre or on a via)
+3V3  (via drill 0.6)  (1 unrouted)
  Top 0.254: v40.64,64.52 42.42,64.52 43.24,63.69 X3.2 | R39.2 82.11,78.17
  Top 0.305: U1.100 54.38,34.47 v52.45,36.4 53.36,35.49 | v36.91,35.79 36.15,35.79 U1.50 | v44.52,43.41 44.52,43.69 U1.27 | v49.1,39.75 50.19,39.75 U1.11 | U1.21 46.51,43.11 v46.51,42.34 47.71,43.55 U1.20 52.09,48.01 54.1,48.01 54.36,47.75 64.77,47.75 66.22,46.3 | v45.13,27.56 45.08,27.56 U1.75 | U$2.P$1 55.78,24.95 U$2.P$16 57.48,26.15 C15.1 58.13,26.49 58.8,26.49 59.56,27.26 v59.56,27.76 61.55,27.76 62.23,28.45 62.23,28.96 | U$2.P$5 53.48,26.16 | 53.48,26.16 v53.48,26.99 v53.47,27 | R6.2 7.99,30.11 v8.13,29.97 | v9.65,7.62 25.91,7.62 26.67,8.38 | v47.12,22.94 49.4,22.94 v51.43,24.97 52.29,24.97 53.48,26.16 | R5.2 62.34,29.07 62.23,28.96 | 62.23,28.96 R4.2 | v79.76,9.91 80.01,9.91 82.55,7.37 82.55,5.84 v82.3,5.59 | C26.1 72.85,26.42 72.34,26.92 | R1.2 66.22,46.3 | 66.22,46.3 66.22,48.19 67.06,49.02 85.82,49.02 BOOT.2 | v11.18,51.05 11.18,55.12 v11.43,55.37 | X2.17 43.24,53.15 v43.94,53.85 | R37.2 9.84,75.69 R32.2 10.86,75.5 11.18,75.18 11.18,72.39 v13.21,70.36 | R38.2 10.41,68.58 v11.43,67.56 | R30.2 21.02,75.5 21.34,75.18 21.34,72.14 22.1,71.37 23.11,71.37 v23.62,70.87 | R28.2 31.18,75.5 31.5,75.18 31.5,71.63 32,71.12 v33.53,71.12 | R26.2 41.09,75.5 41.4,75.18 41.4,72.52 42.55,71.37 v43.43,71.37 | v45.47,72.9 R35.2 | R36.2 48.77,72.9 v48.51,72.64 | R24.2 52.89,75.5 52.58,75.18 52.58,71.88 v52.07,71.37 | R20.2 72.45,75.5 72.14,75.18 72.14,71.37 v71.63,70.87 | 62.23,71.37 62.23,75.18 62.55,75.5 R22.2 | R34.2 84.84,72.14 85.6,72.9 85.6,74.68 84.84,75.44 83.89,75.44 83.82,75.37 | 83.82,75.37 R18.2 82.36,75.25 82.3,75.18 82.3,71.37 81.53,70.61 v80.77,70.61 | 83.82,75.37 83.82,75.95 82.3,77.47 82.3,78.55 R39.2
  Top 0.406: 52.96,35.89 v52.45,36.4 | U$10.P$3 27.96,12.97 26.67,11.68 26.67,8.38 26.67,7.11 v25.91,6.35 | U2.7 U2.8 72.34,26.92 72.34,25.86 v69.34,22.86 | 62.23,71.37 v61.72,70.87
  Top 0.813: v15.49,26.92 15.49,25.49 C22.+ | C24.+ 12.11,50.12 v11.18,51.05
  Bottom 0.305: 37.21,36.09 v36.91,35.79 | C7.1 38.73,33.97 38.12,34.57 | C6.1 42.09,40.98 41.78,40.67 | C9.1 51.22,37.91 51.08,37.77 | C8.1 46.51,26.19 | 48.92,22.37 49.11,22.18 | v59.56,27.76 58.04,27.76 57.78,28.02 54.99,28.02 53.96,26.99 v53.48,26.99 | v47.12,22.94 47.12,23.95 47.78,24.62 | v8.13,29.97 8.13,28.96 | R16.2 9.91,7.37 v9.65,7.62 | R17.2 69.66,9.97 70.1,10.41 79.25,10.41 v79.76,9.91 | v82.3,5.59 82.3,4.38 R15.2 | R13.2 10.92,54.86 v11.43,55.37 | 42.7,72.39 LED11.A | v13.21,70.36 12.57,70.36 | v11.43,67.56 12.45,67.56 12.95,68.07 12.95,68.96 12.57,69.34 | v23.62,70.87 22.73,70.87 | v33.53,71.12 32.64,71.12 | v43.43,71.37 42.55,71.37 | LED10.A 50.39,72.55 49.78,73.15 48.51,73.15 | 48.51,73.15 45.72,73.15 v45.47,72.9 | v48.51,72.64 48.51,73.15 | v52.07,71.37 51.44,71.37 | v71.63,70.87 70.61,70.87 | v80.77,70.61 80.77,72.42 | BOOT.2 84.83,50.55 83.57,51.82 83.57,54.54 R14.2
  Bottom 0.406: U$1.P$3 64.79,14.97 65.53,14.22 65.53,10.67 | 65.53,10.67 65.53,6.35 59.94,0.76 33.27,0.76 27.69,6.35 | 27.69,6.35 26.67,7.37 26.67,19.81 23.88,22.61 15.75,22.61 15.49,22.86 | v25.91,6.35 27.69,6.35 | R17.2 67.56,8.64 65.53,10.67 | v69.34,22.86 60.45,22.86 59.44,23.88 59.44,27.64 v59.56,27.76 | LED9.A 61.09,70.87 | 61.09,70.87 61.09,69.22 60.71,68.83 | 61.09,70.87 v61.72,70.87
  Bottom 0.61: v52.45,36.4 51.08,37.77 v49.1,39.75 v46.51,42.34 45.44,43.41 v44.52,43.41 | 41.78,40.67 37.21,36.09 | 37.21,36.09 37.21,35.49 38.12,34.57 v45.13,27.56 46.51,26.19 46.96,25.73 | C8.1 47.78,24.62 49.11,23.29 48.92,23.1 C16.1 48.92,22.37 | 4.32,52.07 3.56,51.31 3.56,40.64 | 3.56,40.64 3.56,32.51 7.11,28.96 8.13,28.96 12.45,28.96 15.49,25.91 | 3.56,40.64 4.75,39.45 USART.4 12.24,40.64 25.15,40.64 27.18,42.67 31.5,42.67 37.21,36.96 37.21,36.09 | LED14.A 12.57,70.36 12.57,69.34 12.57,69.22 12.95,68.83 23.11,68.83 | 23.11,68.83 32.77,68.83 | 32.77,68.83 42.16,68.83 42.29,68.71 42.55,68.71 | 51.31,68.83 42.67,68.83 42.55,68.71 | 51.31,68.83 60.71,68.83 70.36,68.83 | 70.36,68.83 80.26,68.83 80.77,69.34 v80.77,70.61 | 80.77,72.42 LED7.A | LED8.A 70.61,70.87 70.61,69.09 70.36,68.83 | LED10.A 51.44,71.37 51.44,68.96 51.31,68.83 | LED11.A 42.55,71.37 42.55,68.71 | LED13.A 22.73,70.87 22.73,69.22 23.11,68.83 | LED12.A 32.64,71.12 32.64,68.96 32.77,68.83 | 42.55,68.71 42.55,67.44 40.64,65.53 v40.64,64.52
  Bottom 0.813: C12.1 6.74,17.22 C13.1 9.23,17.27 10.92,17.27 11.48,16.71 IC1.3 11.48,18.85 15.49,22.86 15.49,25.91 v15.49,26.92 | CAMERA.1 11.18,47.5 v11.18,51.05 11.18,51.56 10.67,52.07 4.32,52.07 | v44.52,43.41 43.66,43.41 | C6.1 42.09,41.84 43.66,43.41 | v43.94,53.85 43.94,43.69 43.66,43.41
ADC0
  Top 0.305: X2.4 49.74,47.06 U1.22
ADC1
  Top 0.305: X2.5 49.24,47.28 U1.23
ADC1_S  (via drill 0.6)
  Top 0.305: R18.1 83.69,70.99 v83.82,70.87 81.03,68.07 50.55,68.07 49.24,66.77 X3.14
  Bottom 0.305: v83.82,70.87 83.82,72.52 U$11.P$2
ADC2
  Top 0.305: X2.6 48.74,47.49 U1.24
ADC2_S  (via drill 0.6)
  Top 0.305: X3.13 48.74,67.03 50.55,68.83 72.14,68.83 73.41,70.1 v73.41,71.37 R20.1
  Bottom 0.305: v73.41,71.37 U$14.P$2
ADC3
  Top 0.305: X2.7 48.24,47.68 U1.25
ADC3_S  (via drill 0.6)
  Top 0.305: X3.12 48.24,67.54 50.29,69.6 62.99,69.6 63.75,70.36 v63.75,71.37 63.63,71.5 R22.1
  Bottom 0.305: v63.75,71.37 63.75,72.52 U$15.P$2
ADC4
  Top 0.305: X2.8 47.74,48.25 45.47,45.97 44.2,45.97 43.43,46.74 42.93,46.74 42.16,45.97 42.16,45.33 U1.28
ADC4_S  (via drill 0.6)
  Top 0.305: X3.11 47.74,67.81 50.29,70.36 52.83,70.36 v53.85,71.37 53.98,71.5 R24.1
  Bottom 0.305: v53.85,71.37 53.85,72.52 U$16.P$2
ADC5
  Top 0.305: X2.9 47.24,48.51 45.47,46.74 44.45,46.74 43.69,47.5 42.67,47.5 41.4,46.23 41.4,45.37 U1.29
ADC6
  Top 0.305: X2.10 46.74,49.03 45.21,47.5 44.7,47.5 43.94,48.26 42.42,48.26 40.64,46.48 40.64,45.42 U1.30
ADC6_S  (via drill 0.6)
  Top 0.305: X3.9 46.74,67.31 43.69,70.36 40.64,70.36 40.13,70.87 v40.13,71.37 40.26,71.5 R26.1
  Bottom 0.305: v40.13,71.37 40.13,72.52 U$17.P$2
ADC7
  Top 0.305: X2.11 46.24,49.54 45.21,48.51 44.7,48.51 44.45,48.77 41.66,48.77 39.88,46.99 39.88,45.5 U1.31
ADC7_S  (via drill 0.6)
  Top 0.305: X3.8 46.24,66.79 43.43,69.6 30.48,69.6 29.97,70.1 v29.97,71.37 30.1,71.5 R28.1
  Bottom 0.305: v29.97,71.37 29.97,72.52 U$18.P$2
ADC8
  Top 0.305: X2.12 45.74,49.8 45.21,49.28 41.4,49.28 39.37,47.24 39.37,45.29 U1.32
ADC8_S  (via drill 0.6)
  Top 0.305: X3.7 45.74,66.27 43.18,68.83 21.34,68.83 20.07,70.1 v20.07,71.37 20.19,71.5 R30.1
  Bottom 0.305: v20.07,71.37 20.07,72.52 U$19.P$2
ADC9
  Top 0.305: X2.13 45.24,50.07 44.96,49.78 41.15,49.78 38.86,47.5 38.86,45.08 U1.33
ADC9_S  (via drill 0.6)
  Top 0.305: X3.6 45.24,65.5 42.67,68.07 13.21,68.07 v10.16,71.12 10.03,71.25 R32.1
  Bottom 0.305: v10.16,71.12 10.16,72.52 U$20.P$2
ADC10
  Top 0.305: X2.14 44.74,50.58 44.45,50.29 40.89,50.29 38.35,47.75 38.35,44.9 U1.34
ADC11  (via drill 0.6)
  Top 0.305: CAMERA.3 16.76,45.72 18.03,44.45 22.1,44.45 22.86,43.69 23.62,43.69 v23.88,43.43 | v37.34,46.23 37.34,45.2 U1.35
  Bottom 0.305: v23.88,43.43 34.54,43.43 v37.34,46.23
BOOT  (via drill 0.6)
  Top 0.305: U1.94 53.08,31.57 54.48,31.57 57.96,35.05 59.44,35.05 60.38,35.99 61.29,35.99 R2.2 76.26,36.01 76.71,35.56 v76.71,35.31
  Bottom 0.305: BOOT.1 90.17,50.27 90.17,37.85 87.12,34.8 77.22,34.8 v76.71,35.31
CAM_CLK
  Top 0.305: CAMERA.5 21.84,45.97 23.11,44.7 24.89,44.7 26.16,43.43 36.27,43.43 36.77,42.93 37.05,42.64 U1.39
CAM_SI
  Top 0.305: CAMERA.6 24.38,45.97 26.42,43.94 36.48,43.94 36.98,43.43 37.67,42.75 U1.38
ENC_A_LEFT  (via drill 0.6)
  Top 0.305: U$10.P$4 31.48,14.97 32.26,15.75 32.26,20.83 28.7,24.38 v27.94,24.38 | v33.02,29.97 34.54,29.97 35.31,29.21 38.25,29.21 U1.63
  Bottom 0.305: v27.94,24.38 27.94,24.89 v33.02,29.97
ENC_A_RIGHT
  Top 0.305: U$1.P$4 64.53,12.97 65.28,13.72 65.28,20.57 61.21,24.64 61.21,26.16 63.75,28.7 63.75,32.77 63.25,33.27 58.17,33.27 54.36,29.46 52.35,29.46 U1.90
ENC_B_LEFT  (via drill 0.6)
  Top 0.305: U$10.P$5 30.69,16.97 31.24,17.53 31.24,19.81 28.19,22.86 27.18,22.86 26.16,23.88 26.16,25.4 v26.67,25.91 | v31.75,30.99 31.75,29.72 33.02,28.45 38.21,28.45 U1.64
  Bottom 0.305: v26.67,25.91 v31.75,30.99
ENC_B_RIGHT
  Top 0.305: U$1.P$5 64.82,10.97 66.04,12.19 66.04,21.08 61.98,25.15 61.98,25.91 64.52,28.45 64.52,33.02 63.5,34.04 57.91,34.04 54.1,30.23 52.31,30.23 U1.91
FRONT_GPIO  (via drill 0.6)
  Top 0.305: X2.3 50.24,48.82 v50.8,48.26 | v50.8,45.21 50.8,44.6 U1.17
  Bottom 0.305: v50.8,48.26 v50.8,45.21
FRONT_SCL  (via drill 0.6)
  Top 0.305: v53.34,45.72 53.34,45.7 U1.15 | X2.1 51.24,51.12 51.82,50.55 52.83,50.55 v53.09,50.29
  Bottom 0.305: v53.09,50.29 53.09,45.97 v53.34,45.72
FRONT_SDA  (via drill 0.6)
  Top 0.305: X2.2 50.74,49.84 51.31,49.28 v52.07,49.28 | v52.07,45.72 52.07,45.15 U1.16
  Bottom 0.305: v52.07,49.28 v52.07,45.72
GND  (via drill 0.6)
  Top 0.254: U$12.P$2_EM 88.18,70.07 87.88,70.36 87.88,71.25 U$12.P$3-NC
  Top 0.305: 62.39,41.43 C2.2 | 48.04,43.27 U1.19 47.57,42.77 47.57,41.58 46.96,40.97 v46.96,40.36 | U1.10 51.25,40.08 v49.25,38.08 | U1.99 54.09,34.16 53.06,35.18 v51.54,35.18 | v38.73,36.09 37.82,37.01 36.91,37.01 36.6,36.7 35.92,36.7 U1.49 34.7,37.92 33.86,37.92 33.55,37.62 33.25,37.62 32.93,37.93 C4.2 | v44.22,41.58 44.52,41.58 45.44,42.5 45.44,44.02 44.83,44.63 44.27,44.63 U1.26 | v44.83,29.39 44.83,28.78 44.22,28.17 44.22,27.39 U1.74 | 42.7,25.86 U1.74 | C5.1 42.09,23 43,23.9 43,24.51 42.39,25.12 42.39,25.56 U1.74 | U$2.P$4 53.98,24.2 54.23,23.95 | U$2.P$8 53.73,23.45 | 53.73,23.45 53.98,23.71 | U$2.P$9 53.48,23.21 53.73,23.45 | U$2.P$10 53.98,23.71 | 53.98,23.71 54.1,23.83 | U$2.P$11 54.48,23.45 54.1,23.83 | U$2.P$13 U$2.P$12 54.98,23.71 54.74,23.95 | 54.74,23.95 U$2.P$15 57.62,23.95 C14.2 | 54.74,23.95 v54.48,23.95 54.23,23.95 | C15.2 57.11,27.85 v56.01,26.75 | 54.23,23.95 54.1,23.83 | v37.08,6.86 39.66,6.86 40.16,7.37 | v54.36,16.26 53.81,16.26 | v10.41,26.92 5.33,26.92 3.81,28.45 3.81,29.21 | 3.81,29.21 4.06,29.46 5.29,29.46 LED2.C | LED1.C 4.42,35.16 3.56,34.29 3.56,29.46 3.81,29.21 | 35.81,11.68 35.22,11.68 C19.2 | X4.M2 1.57,51.61 v1.78,51.82 | RESET.1 86.47,45.36 87.63,44.2 87.63,38.35 85.85,36.58 84.89,36.58 RUN.1 | C26.2 78.23,26.42 79.25,27.43 79.25,28.65 U2.1 | R2.1 61.88,37.91 v62.81,38.84 | C3.2 68.5,47.67 v68.58,47.75 | X2.18 42.74,54.68 43.18,55.12 45.72,55.12 v45.97,55.37 | R11.1 Q3.2 | X3.1 41.95,61.17 v40.39,62.74 | U$29.P$3-NC 51.5,80.26 U$29.P$2_EM 52.3,78.01 v52.32,77.98 | U$12.P$3-NC 85.98,71.75 v85.85,71.63
  Top 0.406: IC2.11 46.66,11.36 IC2.EH@1 | IC2.EH@2 40.16,11.36 40.46,11.36 40.51,11.3 | IC2.33 47.31,12.19 | 47.31,12.19 47.31,12.01 | 47.31,12.01 IC2.EH@1 | IC2.35 46.02,12.66 IC2.EH@1 | IC2.34 46.66,12.01 IC2.EH@1 | IC2.32 47.97,12.84 47.31,12.19 | IC2.12 47.31,12.01 | IC2.13 47.97,10.71 IC2.EH@1 | IC2.10 46.02,10.71 46.61,11.3 | 46.74,11.43 IC2.EH@1 | IC2.23 53.81,16.26 53.81,12.41 53.59,12.19 | 53.59,12.19 52.83,11.43 46.74,11.43 | 46.74,11.43 46.61,11.3 | 53.59,12.19 54.1,11.68 IC2.EH@3 55.41,10.41 v55.63,10.41 | IC2.1 40.16,7.37 40.16,10.96 40.51,11.3 | 40.51,11.3 40.64,11.43 46.48,11.43 46.61,11.3 | R7.1 57.34,16.74 57.4,16.68 | v38.61,13.21 38.61,11.94 38.35,11.68 | 11.05,28.96 11.3,28.7 17.78,28.7 19.9,26.59 Q4.2 R12.1 | U$1.P$6 67.23,8.97 69.34,6.86 U$9.GND | v83.82,46.48 83.82,46.27 RESET.1 | v9.4,23.37 9.4,23.79 C22.- | U2.1 U2.2 U2.3 U2.4 79.07,35.48 v77.22,37.34 | 62.66,45.18 62.66,38.99 v62.81,38.84 | Q3.2 28.64,48.96 v28.19,48.51 | 16.26,54.61 17.7,53.17 Q2.2 R10.1 | U$31.P$3-NC 5.33,72.14 5.33,73.15 6.6,73.15 v7.62,74.17
  Top 0.61: 62.66,45.18 C1.2 62.39,41.43 | C2.2 | USART.1 11.05,28.96 11.05,25.44 C22.- | 7.59,41.66 X4.M4 | X4.5 7.57,41.88 X4.M4 | X4.M1 X4.M2 X4.M3 | v10.41,42.67 8.37,42.67 X4.M4 | U$31.P$2_EM 5.11,73.38 5.33,73.15
  Top 0.813: v10.41,26.92 10.41,25.49 C22.- | C23.2 29.04,3.9 29.46,4.32 | C24.- 16.17,54.52 16.26,54.61 v16.76,55.12
  Top 1.27: IC2.EH@2 38.35,11.68 35.81,11.68 35.05,10.92 C20.- 34.88,7.87 33.27,7.87 29.72,4.32 29.46,4.32 BAT.1 | C21.- 57.4,16.68 56.56,16.68 55.88,16 55.88,12.45 55.12,11.68 IC2.EH@3
  Bottom 0.305: 45.74,41.58 v46.96,40.36 | C7.2 39.64,35.17 39.34,34.88 | C6.2 42.7,40.07 42.24,39.6 | C9.2 50.33,37 50.16,37.16 | C8.2 47.56,26.66 47.57,26.65 | C16.2 50.62,22.63 | v56.01,26.75 56.01,25.48 v54.48,23.95 53.72,23.19 50.98,23.19 50.8,23.37 | R8.1 38.61,5.33 v37.08,6.86 | R9.2 53.53,17.08 v54.36,16.26 | v68.58,47.75 69.6,46.74 | v52.32,77.98 52.32,78.49 52.58,78.74
  Bottom 0.406: U$10.P$6 35.13,18.97 38.61,15.49 v38.61,13.21 | U$1.P$6 57.07,8.97 v55.63,10.41 | 63.12,40.89 63.12,39.14 v62.81,38.84 | 63.12,40.89 63.12,45.08 64.77,46.74 69.6,46.74 83.57,46.74 v83.82,46.48 | v77.22,37.34 77.22,38.1 74.17,41.15 63.37,41.15 63.12,40.89 | v45.97,55.37 45.72,55.37 44.96,54.61 | v28.19,48.51 28.19,54.61 29.46,55.88 | v7.62,74.17 7.62,75.69 8.38,76.45 9.88,76.45 U$20.P$1
  Bottom 0.61: v51.54,35.18 51.54,35.79 50.16,37.16 v49.25,38.08 45.74,41.58 v44.22,41.58 42.24,39.6 v38.73,36.09 38.73,35.49 39.34,34.88 v44.83,29.39 47.57,26.65 47.98,26.65 50.16,24.46 50.21,24.46 50.8,23.88 50.8,23.37 50.8,23.06 C16.2 | C9.2 53.99,33.05 55.8,33.05 57.33,34.57 57.33,36.65 56.26,37.72 | v10.41,42.67 12.45,42.67 14.22,44.45 CAMERA.2 | U$9.GND 69.34,5.93 C25.2 | 56.26,37.72 45.72,48.26 45.72,53.85 | 44.96,54.61 44.45,55.12 | v62.81,38.84 57.38,38.84 56.26,37.72 | U$20.P$1 10.03,78.11 10.67,78.74 20.07,78.74 | 20.07,78.74 30.23,78.74 | 30.23,78.74 40.39,78.74 | 40.39,78.74 52.58,78.74 53.85,78.74 | 53.85,78.74 63.25,78.74 | 63.25,78.74 73.15,78.74 | 73.15,78.74 82.8,78.74 83.82,77.72 83.82,76.43 U$11.P$1 85.25,76.3 85.85,75.69 v85.85,71.63 85.85,70.87 82.55,67.56 48.26,67.56 43.43,62.74 v40.39,62.74 | U$14.P$1 73.41,78.49 73.15,78.74 | U$15.P$1 63.63,78.36 63.25,78.74 | U$16.P$1 53.98,78.61 53.85,78.74 | U$17.P$1 40.26,78.61 40.39,78.74 | U$18.P$1 30.1,78.61 30.23,78.74 | U$19.P$1 20.19,78.61 20.07,78.74
  Bottom 0.813: C10.2 9.63,13.46 IC1.2 14.22,13.46 14.48,13.72 14.48,18.54 14.73,18.8 24.64,18.8 24.89,18.54 24.89,8.38 24.64,8.13 14.73,8.13 16.76,6.1 BAT.1 | C13.2 9.18,13.01 C10.2 | C12.2 9.13,15.47 C13.2 | C11.2 8.93,12.75 C10.2 | C13.2 5.05,15.52 4.83,15.75 4.83,18.54 5.59,19.3 9.4,19.3 10.67,20.57 10.67,25.91 | 10.67,25.91 10.67,26.67 v10.41,26.92 | 16.76,53.34 2.54,53.34 1.78,52.58 v1.78,51.82 1.78,30.48 5.59,26.67 9.91,26.67 10.67,25.91 | v16.76,55.12 16.76,53.34 | 16.76,53.34 19.3,55.88 29.46,55.88 43.69,55.88 44.96,54.61 45.72,53.85
  other vias: 25.65,38.86 16.76,35.81 19.81,30.73 19.3,19.56 24.13,19.56 45.21,13.97 45.21,9.91 48.51,13.97 48.51,9.91 60.71,4.06 26.42,3.81 91.69,8.89 91.95,26.42 83.57,13.21 76.2,54.1 54.36,51.56 83.31,22.35 67.56,19.56 34.04,20.32 66.29,25.91 59.69,39.37 61.47,21.34 67.31,11.43 74.93,16.51 83.31,38.86 63.25,49.28 2.79,29.21 33.27,35.81 13.72,9.14 51.31,65.79 66.04,70.61 57.15,71.63 36.83,71.37 26.67,71.37 22.61,79.76 17.02,71.37 76.71,70.87 77.98,79.76 77.72,66.29 46.99,57.15 45.97,57.15 44.96,57.15 43.94,57.15 42.93,57.15 41.91,57.15 48.01,57.15 49.02,57.15 50.04,57.15 51.05,57.15
  pour Bottom: -18.29,91.44 116.84,91.44 117.35,-17.27 -17.78,-16
  pour Top: -17.27,89.92 113.03,89.92 113.54,-16.76 -16.76,-16.76
IR_A  (via drill 0.6)
  Top 0.305: X2.15 44.24,51.1 43.94,50.8 40.64,50.8 37.08,47.24 31.24,47.24 v30.48,46.48 | Q2.3 21.76,50.97 v21.08,50.29
  Bottom 0.305: v21.08,50.29 24.13,50.29 27.43,46.99 29.97,46.99 v30.48,46.48
IR_A_CONTROLL
  Top 0.305: Q2.1 24.05,53.17 24.64,52.58 24.64,49.78 25.91,48.51 25.91,46.99 27.94,44.96 36.18,44.96 U1.37
  Top 0.406: R10.2 Q2.1
IR_A_S  (via drill 0.6)
  Top 0.305: X3.4 44.24,64.73 42.42,66.55 13.21,66.55 12.7,66.04 7.87,66.04 6.6,67.31 v6.6,68.07 | R33.1 14.93,73.6 15.49,74.17 15.49,77.72 16.51,78.74 17.27,78.74 | 17.27,78.74 25.4,78.74 | 25.4,78.74 36.32,78.74 | 36.32,78.74 37.34,78.74 | 37.34,78.74 43.18,78.74 43.94,77.98 43.94,73.91 | R29.1 32.7,73.66 35.81,73.66 36.83,74.68 36.83,78.23 36.32,78.74 | R31.1 24.58,73.6 25.15,74.17 25.15,78.49 25.4,78.74 | 43.94,73.91 43.69,73.66 42.61,73.66 R27.1 | v16.26,79.76 17.27,78.74 | 43.94,73.91 43.94,72.9 v45.72,71.12 | v49.78,71.63 49.78,71.95 R25.1 | v38.35,79.76 37.34,78.74 | R21.1 67.88,73.6 67.56,73.91 67.56,77.72 65.28,80.01 | 65.28,80.01 v58.42,80.01 59.69,78.74 59.69,73.91 59.94,73.66 61.03,73.66 R23.1 | R19.1 78.04,73.6 77.47,74.17 77.47,77.72 75.18,80.01 65.28,80.01
  Bottom 0.305: v16.26,79.76 8.38,79.76 6.35,77.72 6.35,70.1 6.6,69.85 v6.6,68.07 | v45.72,71.12 49.28,71.12 v49.78,71.63 | v58.42,80.01 38.61,80.01 v38.35,79.76
IR_B
  Top 0.305: X2.16 43.74,51.61 43.43,51.31 39.62,51.31 36.32,48.01 30.99,48.01 30.23,48.77 30.23,52.83 28.7,54.36 27.77,54.36 Q3.3
IR_B_CONTROLL
  Top 0.305: Q3.1 R11.2 26.74,47.94 29.21,45.47 36.35,45.47 U1.36
IR_B_S  (via drill 0.6)
  Top 0.305: X3.3 43.74,64.21 42.42,65.53 39.88,65.53 39.62,65.79 38.86,65.79 v38.35,65.28 | 35.31,80.77 3.81,80.77 3.56,80.52 3.56,76.45 4.04,75.97 U$30.P$1_COL 5.07,75.95 8.13,75.95 8.64,75.44 8.64,73.41 8.38,73.15 v8.38,70.36 | 35.31,80.77 41.65,80.77 U$13.P$1_COL 41.94,81.56 | U$32.P$1_COL 86.88,80.77 86.87,80.77 86.36,81.28 v54.86,81.28 | v35.31,80.01 35.31,80.77
  Bottom 0.305: v54.86,81.28 36.58,81.28 v35.31,80.01 | v38.35,65.28 38.35,66.55 37.59,67.31 13.21,67.31 12.45,66.55 9.4,66.55 9.14,66.8 9.14,69.6 v8.38,70.36
IR_FRONT_S
  Top 0.305: U$29.P$1_COL 48.77,81.04 R36.1 48.7,76.96 47.75,76.96 47.24,76.45 X3.10
IR_LEFT_S
  Top 0.305: X3.5 44.74,64.99 42.42,67.31 13.21,67.31 12.45,66.55 8.64,66.55 8.13,67.06 8.13,68.51 R38.1 6.9,69.88 U$31.P$1_COL 5.08,69.84
IR_REMOTE  (via drill 0.6)
  Top 0.305: U$9.OUT 66.84,2.5 67.82,1.52 73.41,1.52 74.17,2.29 74.17,14.99 64.52,24.64 64.52,26.67 66.29,28.45 66.29,33.02 v64.26,35.05 | v58.67,36.07 55.27,36.07 U1.1
  Bottom 0.305: v64.26,35.05 59.69,35.05 v58.67,36.07
IR_RIGHT_S
  Top 0.305: X3.15 49.74,66.25 50.8,67.31 84.65,67.31 R34.1 84.9,67.06 87.88,67.06 89.41,68.58 89.41,72.64 88.55,73.5 U$12.P$1_COL
KEY  (via drill 0.6)
  Top 0.305: v58.67,37.59 57.99,36.91 57.32,36.91 56.13,38.1 54.93,38.1 U1.2 | v65.28,38.61 80.01,38.61 84.58,34.04 84.58,32.38 RUN.3
  Bottom 0.305: v58.67,37.59 64.26,37.59 v65.28,38.61
LED  (via drill 0.6)
  Top 0.305: R3.2 8.64,37.59 9.14,38.1 18.03,38.1 v18.29,37.85 | v22.61,37.85 33.53,26.92 34.8,26.92 35.31,27.43 39.31,27.43 U1.67
  Bottom 0.305: v18.29,37.85 v22.61,37.85
LED_BACK  (via drill 0.6)
  Top 0.305: Q4.1 R12.2 23.18,24.2 23.62,24.64 23.62,29.46 v23.37,29.72 | v26.67,35.31 26.67,35.05 29.97,31.75 30.99,31.75 31.24,32 33.78,32 35.56,30.23 37.15,30.23 U1.60
  Bottom 0.305: v23.37,29.72 23.37,32 v26.67,35.31
MOTOR_ENABLE  (via drill 0.6)
  Top 0.305: IC2.3 41.47,3.62 40.89,3.05 v39.62,3.05 | v55.12,17.78 55.12,18.98 R7.2 | v45.21,23.62 46.23,23.62 48.51,25.91 48.51,26.95 U1.81
  Top 0.406: IC2.25 52.52,19.5 52.83,19.81 54.68,19.81 R7.2
  Bottom 0.305: v39.62,3.05 42.93,3.05 43.43,2.54 45.72,2.54 46.99,3.81 46.99,19.3 48.77,21.08 | 48.77,21.08 53.66,21.08 R7.2 55.44,18.1 v55.12,17.78 | 48.77,21.08 46.74,21.08 44.96,22.86 44.96,23.37 v45.21,23.62
N$1
  Top 0.305: U1.12 52.18,42.42 53.34,42.42 54.1,41.66 54.1,40.39 54.79,39.7 58.29,39.7 58.55,39.96 58.55,41.03 Q1.3 60.68,41.11 C2.1
N$2
  Top 0.305: 55.82,45.51 Q1.1 56.23,44.15 56.41,43.97 | 56.41,43.97 56.72,43.66 60.38,43.66 60.68,43.97 C1.1 | U1.13 52.22,43.18 55.63,43.18 56.41,43.97
N$3
  Top 0.305: C4.1 34.21,39.13 U1.48
N$4
  Top 0.305: C5.2 40.88,24.76 U1.73
N$5
  Top 0.305: 5.33,38.61 5.35,38.62 LED1.A 6.19,39.49 R3.1
N$6
  Top 0.305: U$2.P$14 56,23.45 56.51,22.94 56.51,22.73 56.9,22.35 59.18,22.35 59.44,22.61 59.44,23.74 C14.1
N$7  (via drill 0.6)
  Top 0.406: IC2.8 44.72,3.57 v44.7,3.56 | IC2.7 44.06,4.2 v44.7,3.56 | IC2.9 45.37,4.22 v44.7,3.56
  Bottom 0.61: v44.7,3.56 44.7,6.6 42.93,8.38 30.58,8.38 U$10.P$1
N$8  (via drill 0.6)
  Top 0.406: IC2.37 44.72,19.32 v44.96,19.56 | IC2.36 45.37,19.15 v44.96,19.56 | IC2.38 44.06,18.92 44.45,19.3 44.7,19.3 v44.96,19.56
  Bottom 0.61: U$10.P$2 39.16,10.97 44.45,16.26 44.45,19.3 44.7,19.56 v44.96,19.56
N$9  (via drill 0.6)
  Top 0.406: IC2.14 48.62,3.2 v48.77,3.05 | IC2.15 49.27,3.54 v48.77,3.05 | IC2.16 49.91,3.43 49.53,3.05 v48.77,3.05
  Bottom 0.61: U$1.P$2 61.42,16.97 61.21,16.76 58.42,16.76 48.77,7.11 v48.77,3.05
N$10  (via drill 0.6)
  Top 0.406: IC2.30 49.27,19.55 | IC2.31 48.62,18.9 v49.28,19.56 49.91,18.92 IC2.29
  Top 0.61: 49.27,19.55 v49.28,19.56
  Bottom 0.61: v49.28,19.56 49.28,16.26 50.55,14.99 54.86,14.99 58.85,18.97 U$1.P$1
N$11
  Top 0.305: LED2.A 5.85,32.78 6.6,33.53 7.84,33.53 R6.1
N$12
  Top 0.406: IC2.41 42.12,16.71 41.66,16.26 37.43,16.26 C17.2
N$13  (via drill 0.6)
  Top 0.305: IC2.2 40.81,6.27 v41.66,7.11
  Bottom 0.305: v41.66,7.11 41.66,5.91 R8.2
N$14
  Top 0.406: IC2.19 51.87,6.65 52.32,7.11 56.81,7.11 C18.1
N$15  (via drill 0.6)
  Top 0.305: IC2.24 53.16,17.1 52.07,16 51.82,16 v51.56,16.26
  Bottom 0.305: v51.56,16.26 51.56,18.22 R9.1
N$16  (via drill 0.6)
  Top 0.305: 10.29,1.65 10.16,1.52 7.87,1.52 7.37,2.03 7.37,8.38 17.7,18.71 Q4.3 17.7,26.5 v16.76,27.43 | 10.29,1.65 v12.19,3.56 | v1.27,54.36 2.54,53.09 9.4,53.09 10.16,52.32 10.16,49.28 10.67,48.77 12.45,48.77 12.95,48.26 12.95,45.47 14.48,43.94 16.76,43.94 21.08,39.62 v21.08,39.37 | v63.25,1.52 60.2,1.52 59.18,0.51 11.43,0.51 10.29,1.65
  Bottom 0.305: v12.19,3.56 12.19,2.26 LED6.C | v16.76,27.43 16.76,28.7 14.48,30.99 14.48,37.59 16.26,39.37 v21.08,39.37 | 80.26,1.78 80.26,1.52 81.03,0.76 81.03,1.04 LED5.C | 2.03,54.86 LED3.C 2.06,54.36 v1.27,54.36 | 80.26,1.78 80.26,7.62 85.09,12.45 85.09,25.91 92.43,33.25 92.43,53.34 LED4.C | 80.26,1.78 79.25,0.76 64.01,0.76 v63.25,1.52
N$17
  Bottom 0.305: LED3.A R13.1
N$18  (via drill 0.6)
  Top 0.61: v3.3,15.49 1.02,17.78 1.02,37.08 4.06,40.13 4.06,42.67 3.43,43.31 3.3,43.43 3.3,45.72 5.41,47.83 X4.1
  Bottom 0.61: v3.3,15.49 3.3,13.96 D1.A
N$19
  Bottom 0.305: R14.1 LED4.A
N$20
  Bottom 0.406: R17.1 71.56,6.45 C25.1 71.84,5.97 U$9.VCC
N$21
  Bottom 0.305: R15.1 84.26,1.31 LED5.A
N$22  (via drill 0.6)
  Top 0.305: R21.2 v70.61,77.47
  Bottom 0.305: v70.61,77.47 LED8.C
N$23
  Bottom 0.305: LED6.A 9.43,3.4 R16.1
N$24  (via drill 0.6)
  Top 0.254: R19.2 80.9,76.07 v79.76,77.22
  Bottom 0.254: v79.76,77.22 79.76,77.19 LED7.C
N$25  (via drill 0.6)
  Top 0.305: R23.2 61.09,77.34 v60.96,77.47
  Bottom 0.305: v60.96,77.47 60.96,76.17 LED9.C
N$26  (via drill 0.6)
  Top 0.305: v50.8,77.47 50.8,76.13 R25.2
  Bottom 0.305: v50.8,77.47 50.8,76.68 LED10.C
N$27  (via drill 0.6)
  Top 0.305: v42.67,77.47 42.67,75.63 R27.2
  Bottom 0.305: LED11.C 42.55,77.34 v42.67,77.47
N$28  (via drill 0.6)
  Top 0.305: v32.77,77.72 32.77,75.63 R29.2
  Bottom 0.305: LED12.C 32.64,77.6 v32.77,77.72
N$29  (via drill 0.6)
  Top 0.305: v22.86,77.72 22.86,75.63 R31.2
  Bottom 0.305: LED13.C 22.73,77.6 v22.86,77.72
N$30  (via drill 0.6)
  Top 0.305: v12.7,77.47 12.7,75.63 R33.2
  Bottom 0.305: LED14.C 12.57,77.34 v12.7,77.47
N$31
  Top 0.406: U$30.P$2_EM 7.21,79.47 R37.1 6.92,77.72 U$30.P$3-NC
N$32
  Top 0.305: U$13.P$2_EM 44.64,80.26 U$13.P$3-NC 45.47,78.49 R35.1
N$33
  Top 0.254: U$32.P$2_EM 88.18,76.92 U$32.P$3-NC 86.36,78.74 R39.1
PWM_A_LEFT  (via drill 0.6)
  Top 0.305: IC2.43 40.81,19.38 40.64,19.56 39.62,19.56 v38.61,18.54 | v30.23,34.54 28.7,36.07 28.7,39.12 31.5,41.91 35.67,41.91 U1.42
  Bottom 0.305: v38.61,18.54 37.85,18.54 35.56,20.83 35.56,21.84 37.85,24.13 37.85,27.94 32.77,33.02 31.75,33.02 v30.23,34.54
PWM_A_RIGHT  (via drill 0.6)
  Top 0.305: IC2.21 53.16,3.98 v53.85,3.3 | v27.69,41.4 28.19,41.4 29.72,42.93 36.09,42.93 U1.40
  Bottom 0.305: v53.85,3.3 53.85,2.79 52.58,1.52 34.29,1.52 27.43,8.38 27.43,21.34 24.64,24.13 24.64,27.69 28.19,31.24 28.19,34.54 27.69,35.05 v27.69,41.4
PWM_B_LEFT  (via drill 0.6)
  Top 0.305: IC2.42 41.47,19.88 v41.66,20.07 | v29.72,37.08 29.72,39.12 32,41.4 35.49,41.4 U1.43
  Bottom 0.305: v41.66,20.07 41.4,20.32 37.08,20.32 36.58,20.83 36.58,21.34 38.86,23.62 38.86,28.19 32.77,34.29 32.51,34.29 v29.72,37.08
PWM_B_RIGHT  (via drill 0.6)
  Top 0.305: IC2.20 52.52,3.49 v52.32,3.3 | v28.7,40.64 28.7,40.89 30.23,42.42 35.88,42.42 U1.41
  Bottom 0.305: v52.32,3.3 52.32,2.54 51.82,2.03 34.8,2.03 28.19,8.64 28.19,21.59 25.4,24.38 25.4,27.18 28.96,30.73 28.96,35.05 28.7,35.31 v28.7,40.64
RESET
  Top 0.305: U1.14 52.52,44.2 53.59,44.2 54.61,45.21 54.61,46.74 54.86,46.99 63.5,46.99 64.26,46.23 64.26,43.18 64.77,42.67 66.08,42.67 R1.1 68.45,42.81 C3.1 82.73,42.86 RESET.3 84.58,41.01
SCL  (via drill 0.6)
  Top 0.305: U$2.P$2 54.98,28.33 54.61,28.7 | 54.61,28.7 52.32,28.7 50.8,27.18 49.72,27.18 U1.83 | 54.61,28.7 57.78,31.88 R5.1 59.05,31.88 v58.42,31.24 | v68.07,31.24 72.21,31.24 U2.6
  Bottom 0.305: v58.42,31.24 v68.07,31.24
SDA  (via drill 0.6)
  Top 0.254: U$2.P$3 54.48,27.56 54.1,27.94
  Top 0.305: 54.1,27.94 52.58,27.94 51.05,26.42 | 51.05,26.42 50.8,26.16 50.02,26.16 U1.82 | R4.1 58.04,29.59 v57.66,29.97 | v52.07,26.42 51.05,26.42 | U2.5 74.8,32.64 v75.18,32.26
  Bottom 0.305: v52.07,26.42 51.94,26.54 51.94,27.3 53.34,28.7 55.37,28.7 56.64,29.97 v57.66,29.97 58.04,29.59 59.69,29.59 61.6,27.69 74.42,27.69 75.18,28.45 v75.18,32.26
USART1_RX  (via drill 0.6)
  Top 0.305: USART.3 18.72,36.91 v20.32,35.31 | v22.1,32.51 v30.73,23.88 | v36.32,24.64 37.92,24.64 U1.69
  Bottom 0.305: v20.32,35.31 20.32,34.29 v22.1,32.51 | v30.73,23.88 35.56,23.88 v36.32,24.64
USART1_TX  (via drill 0.6)
  Top 0.305: v35.31,25.91 38.47,25.91 U1.68 | USART.2 18.46,34.37 19.05,33.78 22.35,33.78 v30.73,25.4
  Bottom 0.305: v30.73,25.4 34.8,25.4 v35.31,25.91
USBDM
  Top 0.305: U1.70 37.62,23.62 35.31,23.62 16.51,42.42 13.72,42.42 10.41,45.72 10.41,46.48 9.87,47.03 X4.2
USBDP
  Top 0.305: U1.71 37.54,22.86 35.05,22.86 16.26,41.66 13.46,41.66 9.65,45.47 9.65,45.97 9.4,46.23 X4.3
VCC
  Top 0.406: IC2.4 42.12,1.73 41.91,1.52 | IC2.5 42.77,1.62 42.67,1.52 | IC2.6 43.41,1.8 43.69,1.52 | IC2.17 50.56,1.8 50.29,1.52 | IC2.18 51.22,1.62 51.31,1.52 | C18.2 58.59,5.5 58.67,5.59 | IC2.39 43.41,20.09 43.18,20.32 42.77,19.91 IC2.40 | IC2.28 50.56,21.06 50.55,21.08 | IC2.27 51.22,20.73 51.56,21.08 | IC2.26 51.87,20.88 52.07,21.08 | 43.69,21.08 38.35,21.08 37.08,19.81 C17.1 37,17.53 35.56,17.53 35.05,17.02 C19.1
  Top 0.813: C23.1 29.04,2.2 29.46,1.78
  Top 1.27: 35.05,2.79 36.32,1.52 41.91,1.52 42.67,1.52 43.69,1.52 50.29,1.52 51.31,1.52 57.91,1.52 58.67,2.29 58.67,5.59 C21.+ 58.76,12.19 60.2,12.19 61.21,13.21 61.21,18.54 58.67,21.08 52.07,21.08 51.56,21.08 50.55,21.08 43.69,21.08 43.18,20.57 43.18,20.32 | C20.+ 35.05,2.79 | 35.05,2.79 34.04,1.78 29.46,1.78 14.48,1.78 14.22,2.03 BAT.2
  Bottom 0.813: 8.89,11.02 C10.1 | C10.1 9.36,10.92 IC1.1 11.43,10.87 11.43,9.4 | C11.1 8.93,11.05 C10.1 | 9.14,11.14 C10.1 | BAT.2 14.22,6.35 11.43,9.14 11.43,9.4 | D1.C 11.42,9.4 11.43,9.4

### Text on the board
tNames: + | + | + | -